# EAGLE schematic v1.0 (EAGLE 8.2.1)

## Sheet 1 of 8: Digital
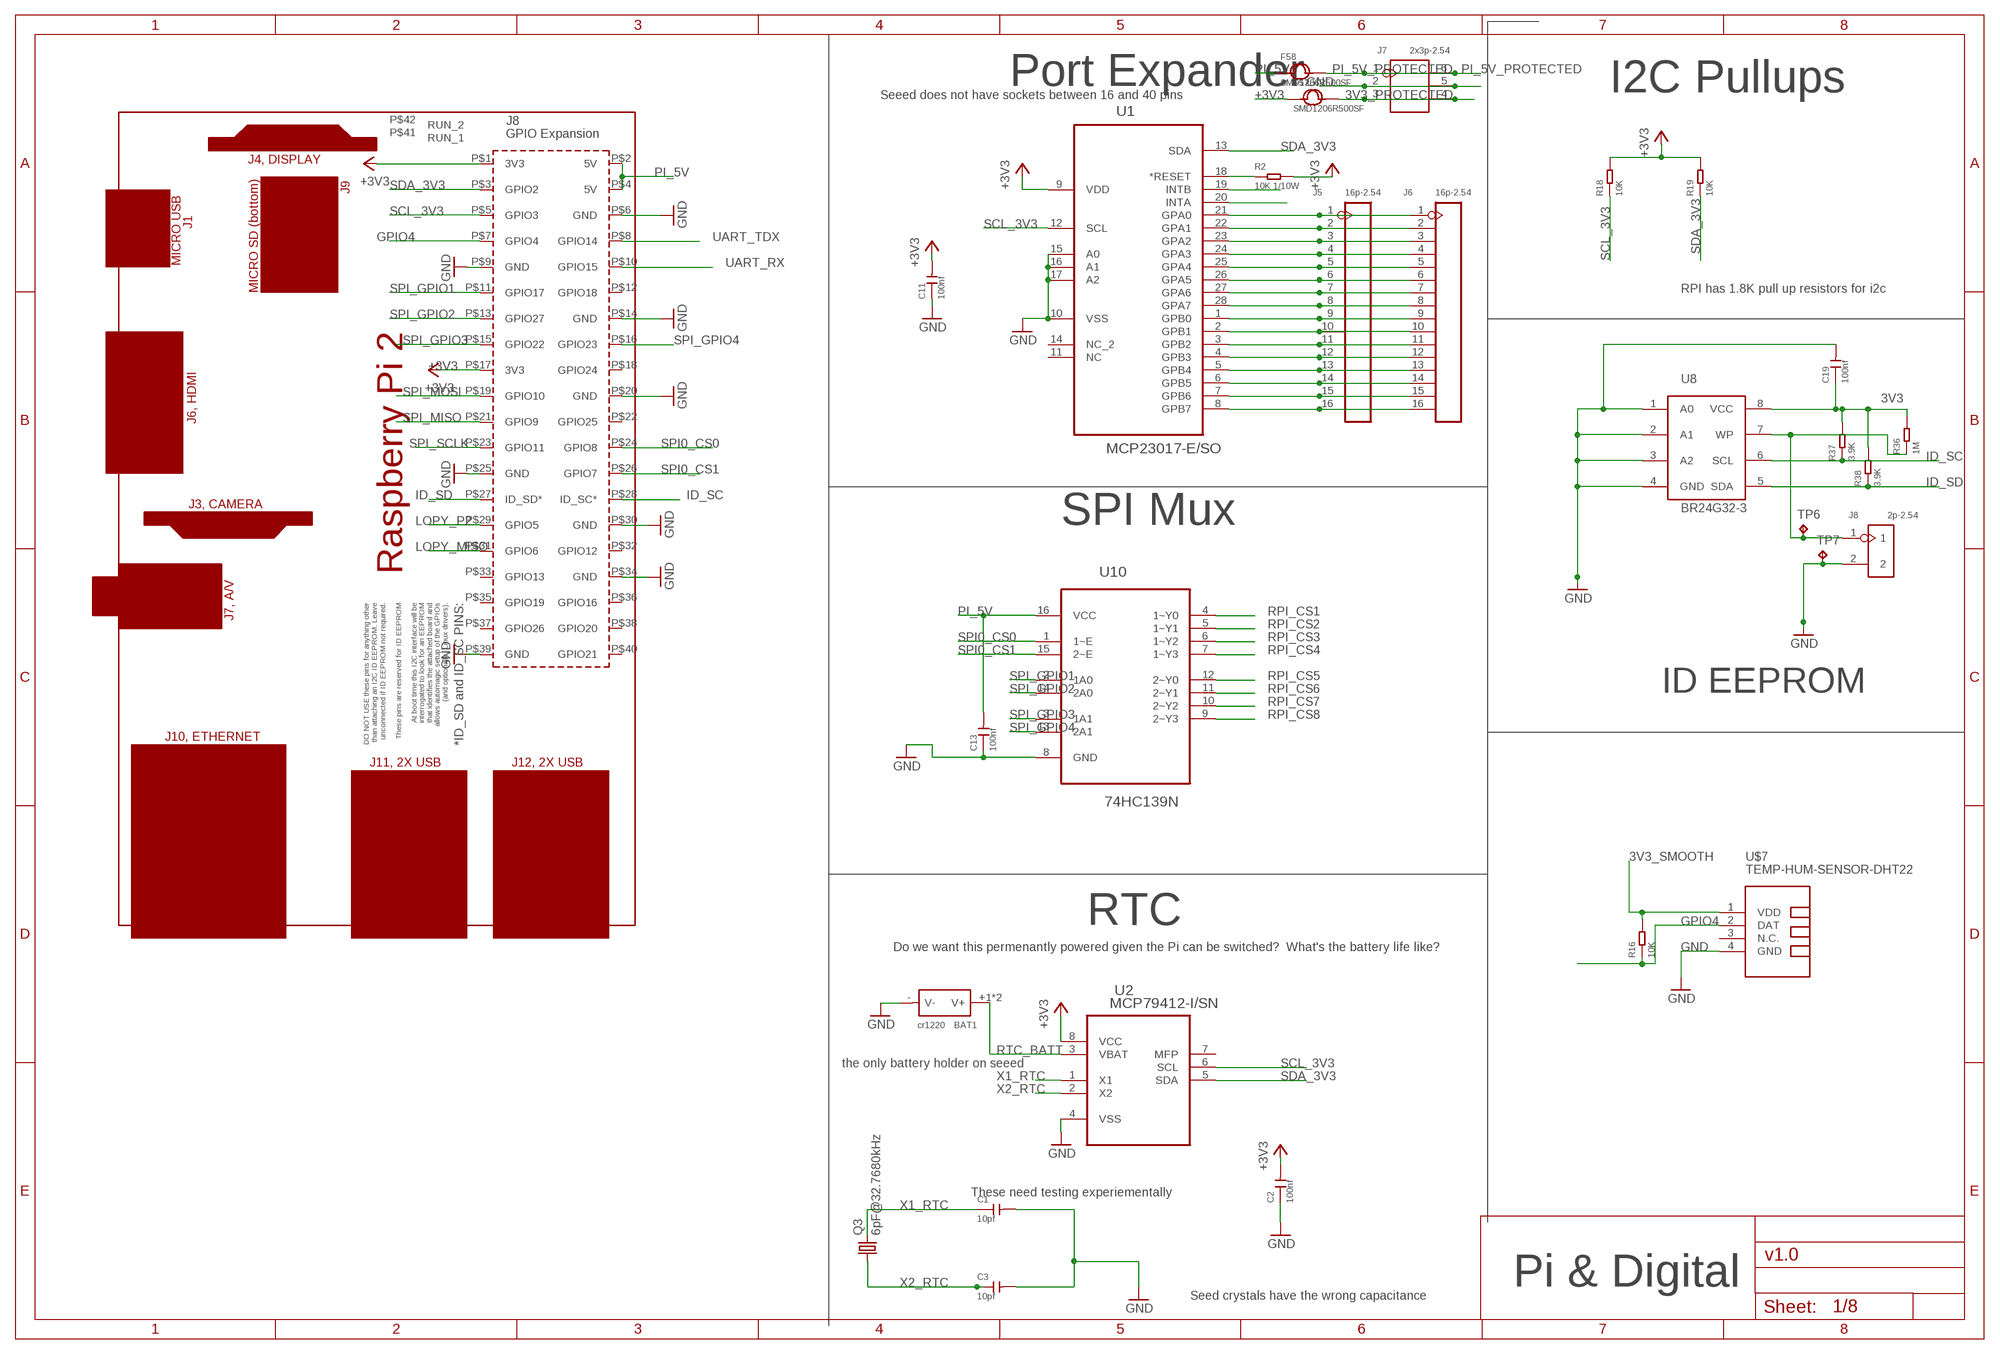
[diagram p0: schematic, sheet 1]

### Parts
BAT1  cr1220  DIP-BATTERY-CELL-HOLDER(1220)  [BAT2P-13.5-CR1220]
C1  10pf  CERAMIC-10PF-50V-5%-NPO(0603)  [C0603]
C2  100nf  CERAMIC-100NF-50V-10%-X7R(0603)  [C0603]
C3  10pf  CERAMIC-10PF-50V-5%-NPO(0603)  [C0603]
C11  100nf  CERAMIC-100NF-50V-10%-X7R(0603)  [C0603]
C13  100nf  CERAMIC-100NF-50V-10%-X7R(0603)  [C0603]
C19  100nf  CERAMIC-100NF-50V-10%-X7R(0603)  [C0603]
F57  SMD1206R500SF  SMD-PPTC-500MA(1206)  [F1206]
F58  SMD1206R500SF  SMD-PPTC-500MA(1206)  [F1206]
J5  16p-2.54  DIP-BLACK-MALE-HEADER-VERT(16P-2.54)  [H16-2.54]
J6  16p-2.54  DIP-BLACK-MALE-HEADER-VERT(16P-2.54)  [H16-2.54]
J7  2x3p-2.54  DIP-BLACK-MALE-HEADER(2X3P-2.54）-2.54  [H2X3-2.54]
J8  2p-2.54  DIP-BLACK-ROUND-FEMALE-HEADER-VERT(2P-2.54)  [H2-2.54]
PCB1  RPI2  [RPI2]
Q3  6pF@32.7680kHz  CRYTAL68SMX  [86SMX]
R2  10K 1/10W  SMD-RES-10K-5%-1/10W(0603)  [R0603]
R16  10K  SMD-RES-10K-1%-1/10W(0603)  [R0603]
R18  10K  SMD-RES-10K-1%-1/10W(0603)  [R0603]
R19  10K  SMD-RES-10K-1%-1/10W(0603)  [R0603]
R36  1M  SMD-RES-1M-1%-1/10W(0603)  [R0603]
R37  3.9K  SMD-RES-3.9K-5%-1/10W(0603)  [R0603]
R38  3.9K  SMD-RES-3.9K-5%-1/10W(0603)  [R0603]
TP6  TPB2,54  [B2,54]
TP7  TPB2,54  [B2,54]
U1  MCP23017-E/SO  [SOIC127P1032X265-28N]
U2  MCP79412-I/SN  [SOIC127P600X175-8N]
U8  BR24G32-3  [SOP8]
U10  74HC139N  [DIP254P762X420-16]
U$7  TEMP-HUM-SENSOR-DHT22  [TEMP-HUM-SENSOR-DHT22]

### Nets
3V3: C19.1 R36.2 R37.2 R38.2 U8.8(VCC)
3V3_PROTECTED: F57.2 J7.3 J7.4
3V3_SMOOTH: R16.2 U$7.1(VDD) ; also sheet 3,5,6
+3V3: C2.2 C11.2 F57.1 PCB1.P$1(3V3) PCB1.P$17(3V3) R2.2 R18.2 R19.2 U1.9(VDD) U2.8(VCC) ; also sheet 3,5
GND: BAT1.-(V-) C1.2 C2.1 C3.2 C11.1 C13.1 C19.2 J7.2 J7.5 J8.2 PCB1.P$6(GND) PCB1.P$9(GND) PCB1.P$14(GND) PCB1.P$20(GND) PCB1.P$25(GND) PCB1.P$30(GND) PCB1.P$34(GND) PCB1.P$39(GND) TP7.TP U1.10(VSS) U1.15(A0) U1.16(A1) U1.17(A2) U2.4(VSS) U8.1(A0) U8.2(A1) U8.3(A2) U8.4(GND) U10.8(GND) U$7.4(GND) ; also sheet 2,3,5,6,7,8
GPIO4: PCB1.P$7(GPIO4) R16.1 U$7.2(DAT)
ID_SC: PCB1.P$28(ID_SC*) R37.1 U8.6(SCL)
ID_SD: PCB1.P$27(ID_SD*) R38.1 U8.5(SDA)
LOPY_MISO: PCB1.P$31(GPIO6) ; also sheet 2
LOPY_P2: PCB1.P$29(GPIO5) ; also sheet 2
N$1: R2.1 U1.18(*RESET)
N$2: U1.19(INTB)
N$3: U1.20(INTA)
N$8: J5.1 J6.1 U1.21(GPA0)
N$12: J5.2 J6.2 U1.22(GPA1)
N$13: J5.3 J6.3 U1.23(GPA2)
N$14: J5.4 J6.4 U1.24(GPA3)
N$15: J5.5 J6.5 U1.25(GPA4)
N$16: J5.6 J6.6 U1.26(GPA5)
N$19: J5.7 J6.7 U1.27(GPA6)
N$22: J5.8 J6.8 U1.28(GPA7)
N$24: J5.9 J6.9 U1.1(GPB0)
N$26: J5.10 J6.10 U1.2(GPB1)
N$27: J5.11 J6.11 U1.3(GPB2)
N$35: J5.12 J6.12 U1.4(GPB3)
N$36: J5.13 J6.13 U1.5(GPB4)
N$37: J5.14 J6.14 U1.6(GPB5)
N$39: J5.15 J6.15 U1.7(GPB6)
N$40: J5.16 J6.16 U1.8(GPB7)
N$97: J8.1 R36.1 TP6.TP U8.7(WP)
PI_5V: C13.2 F58.1 PCB1.P$2(5V) PCB1.P$4(5V) U10.16(VCC) ; also sheet 3,5,6,7,8
PI_5V_PROTECTED: F58.2 J7.1 J7.6
RPI_CS1: U10.4(1~Y0) ; also sheet 6
RPI_CS2: U10.5(1~Y1) ; also sheet 6
RPI_CS3: U10.6(1~Y2) ; also sheet 6
RPI_CS4: U10.7(1~Y3) ; also sheet 6
RPI_CS5: U10.12(2~Y0) ; also sheet 6
RPI_CS6: U10.11(2~Y1) ; also sheet 6
RPI_CS7: U10.10(2~Y2) ; also sheet 6
RPI_CS8: U10.9(2~Y3) ; also sheet 6
RTC_BATT: BAT1.+1(V+) BAT1.+2(V+) U2.3(VBAT)
SCL_3V3: PCB1.P$5(GPIO3) R18.1 U1.12(SCL) U2.6(SCL) ; also sheet 4,6
SDA_3V3: PCB1.P$3(GPIO2) R19.1 U1.13(SDA) U2.5(SDA) ; also sheet 4,6
SPI0_CS0: PCB1.P$24(GPIO8) U10.1(1~E)
SPI0_CS1: PCB1.P$26(GPIO7) U10.15(2~E)
SPI_GPIO1: PCB1.P$11(GPIO17) U10.2(1A0)
SPI_GPIO2: PCB1.P$13(GPIO27) U10.14(2A0)
SPI_GPIO3: PCB1.P$15(GPIO22) U10.3(1A1)
SPI_GPIO4: PCB1.P$16(GPIO23) U10.13(2A1)
SPI_MISO: PCB1.P$21(GPIO9) ; also sheet 6
SPI_MOSI: PCB1.P$19(GPIO10) ; also sheet 6
SPI_SCLK: PCB1.P$23(GPIO11) ; also sheet 6
UART_RX: PCB1.P$10(GPIO15) ; also sheet 6
UART_TDX: PCB1.P$8(GPIO14) ; also sheet 6
X1_RTC: C1.1 Q3.4 U2.1(X1)
X2_RTC: C3.1 Q3.1 U2.2(X2)
Unconnected: PCB1.P$12(GPIO18) PCB1.P$18(GPIO24) PCB1.P$22(GPIO25) PCB1.P$32(GPIO12) PCB1.P$33(GPIO13) PCB1.P$35(GPIO19) PCB1.P$36(GPIO16) PCB1.P$37(GPIO26) PCB1.P$38(GPIO20) PCB1.P$40(GPIO21) PCB1.P$41(RUN_1) PCB1.P$42(RUN_2) U1.11(NC) U1.14(NC_2) U2.7(MFP) U$7.3(N.C.)

### Notes on the sheet
- Port Expander | I2C Pullups
- Seeed does not have sockets between 16 and 40 pins
- RPI has 1.8K pull up resistors for i2c
- SPI Mux
- ID EEPROM
- RTC
- Do we want this permenantly powered given the Pi can be switched?  What's the battery life like?
- the only battery holder on seeed
- These need testing experiementally
- Pi & Digital
- Seed crystals have the wrong capacitance

## Sheet 2 of 8: PyCom
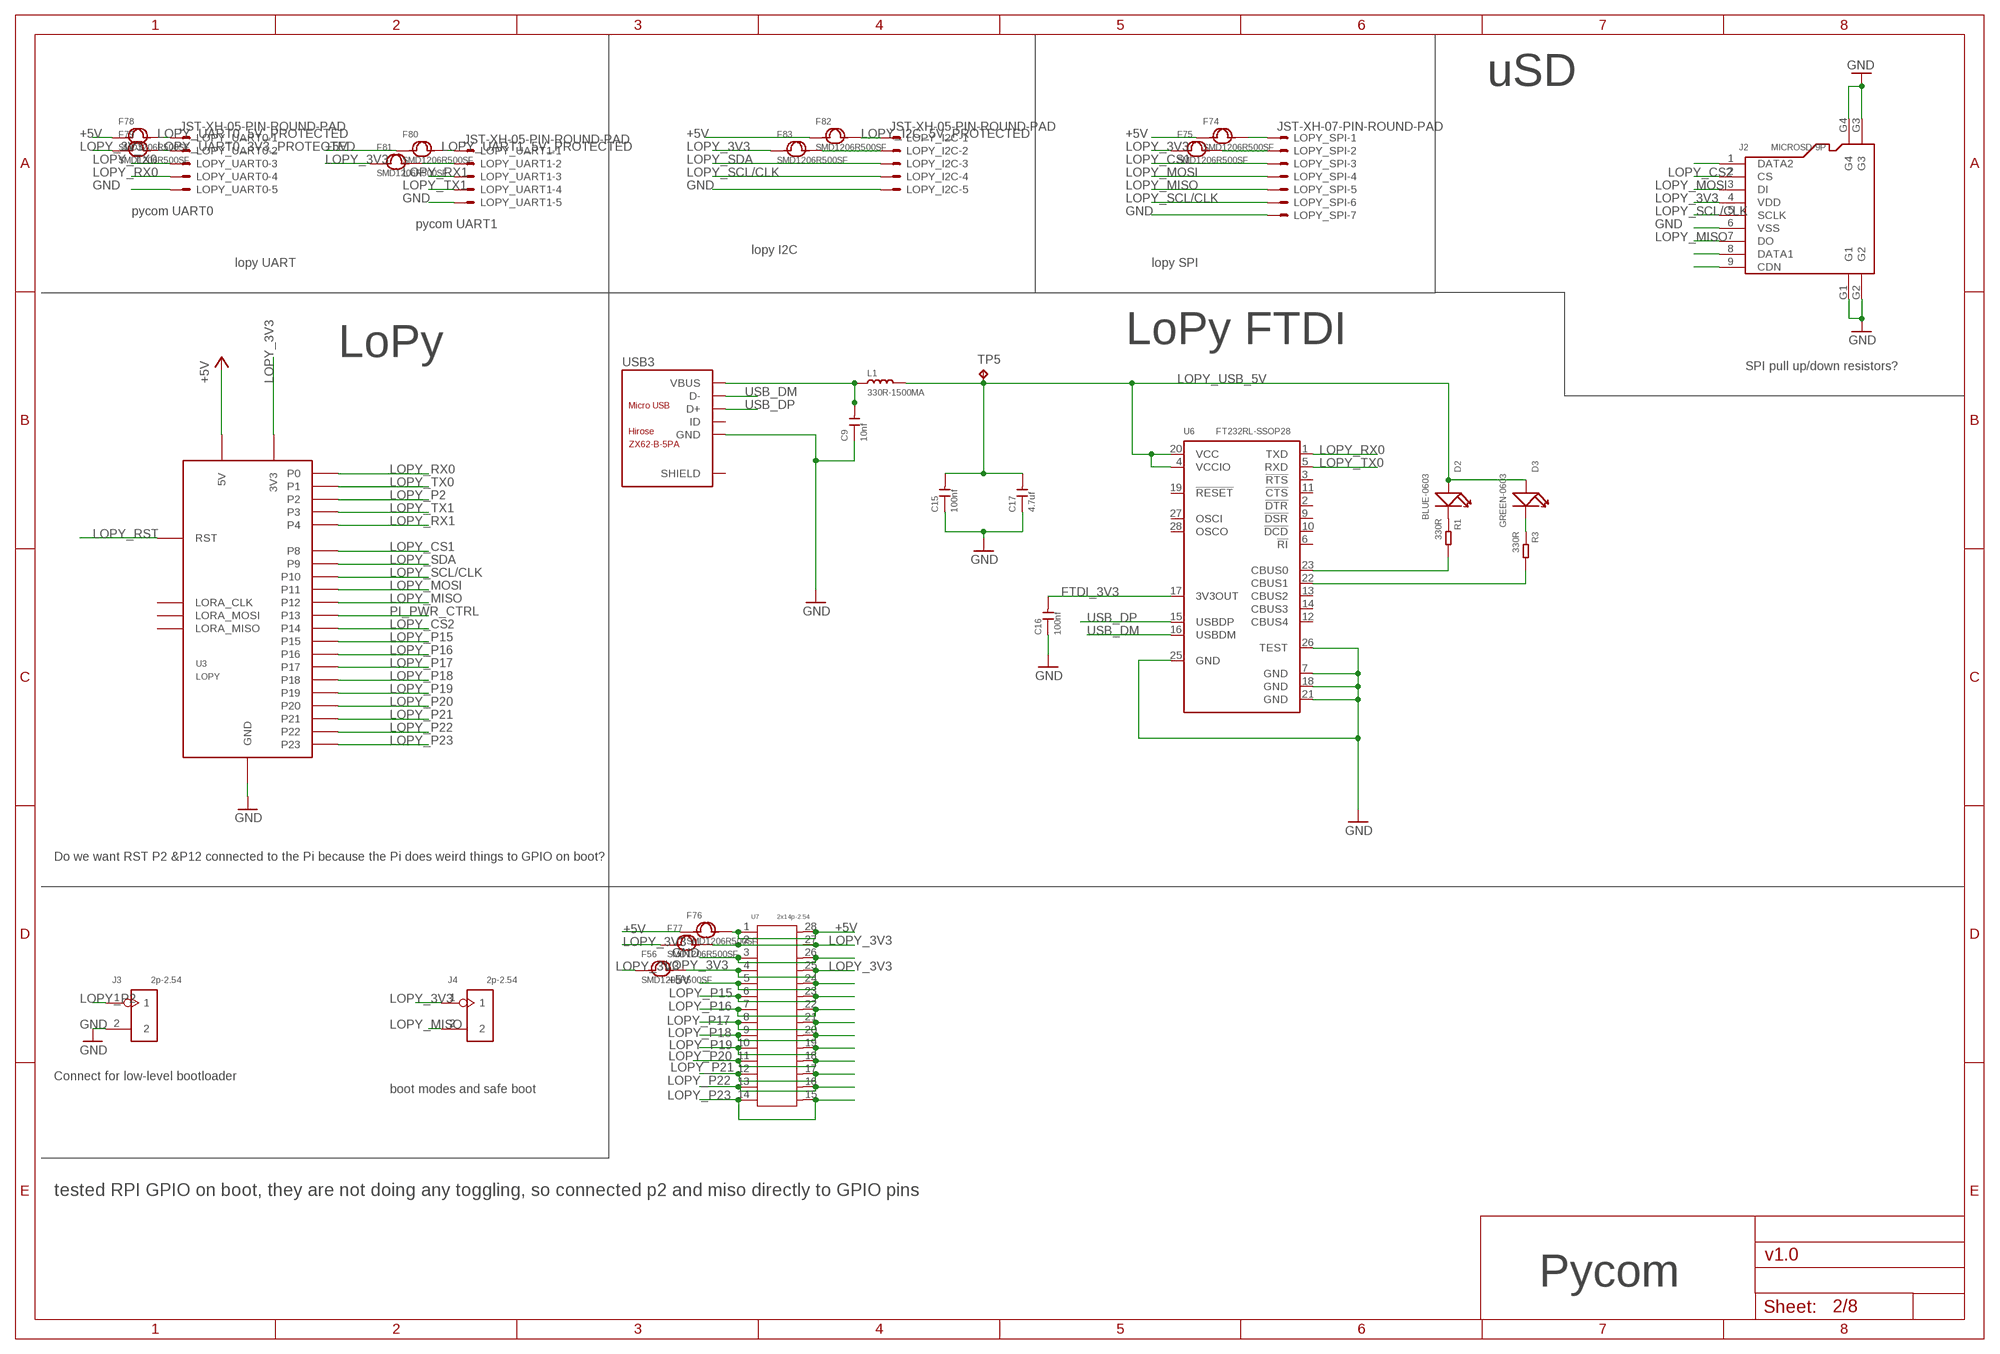
[diagram p1: schematic, sheet 2]

### Parts
C9  10nf  CERAMIC-10NF-50V-5%-X7R(0805)  [C0805]
C15  100nf  CERAMIC-100NF-50V-10%-X7R(0603)  [C0603]
C16  100nf  CERAMIC-100NF-50V-10%-X7R(0603)  [C0603]
C17  4.7uf  CERAMIC-4.7UF-10V-10%-X5R(0603)  [C0603]
D2  BLUE-0603  SMD-LED-CLEAR-BLUE(0603)  [LED-0603]
D3  GREEN-0603  SMD-LED-CLEAR-GREEN(0603)  [LED-0603]
F56  SMD1206R500SF  SMD-PPTC-500MA(1206)  [F1206]
F74  SMD1206R500SF  SMD-PPTC-500MA(1206)  [F1206]
F75  SMD1206R500SF  SMD-PPTC-500MA(1206)  [F1206]
F76  SMD1206R500SF  SMD-PPTC-500MA(1206)  [F1206]
F77  SMD1206R500SF  SMD-PPTC-500MA(1206)  [F1206]
F78  SMD1206R500SF  SMD-PPTC-500MA(1206)  [F1206]
F79  SMD1206R500SF  SMD-PPTC-500MA(1206)  [F1206]
F80  SMD1206R500SF  SMD-PPTC-500MA(1206)  [F1206]
F81  SMD1206R500SF  SMD-PPTC-500MA(1206)  [F1206]
F82  SMD1206R500SF  SMD-PPTC-500MA(1206)  [F1206]
F83  SMD1206R500SF  SMD-PPTC-500MA(1206)  [F1206]
J2  MICROSD-9P  MICRO-SD-CARD-HOLDER-9P  [MICRO-SD9+4P-SMD-16.1X14.5X1.85MM]
J3  2p-2.54  DIP-BLACK-MALE-HEADER-VERT(2P-2.54)  [H2-2.54]
J4  2p-2.54  DIP-BLACK-MALE-HEADER-VERT(2P-2.54)  [H2-2.54]
L1  330R-1500MA  SMD-FERRITE-BEAD-330R-1500MA(0805)'0805'  [L0805]
LOPY_I2C  JST-XH-05-PIN-ROUND-PAD  [JST-XH-05-PACKAGE-ROUND-PAD]
LOPY_SPI  JST-XH-07-PIN-ROUND-PAD  [JST-XH-07-PACKAGE-ROUND-PAD]
LOPY_UART0  JST-XH-05-PIN-ROUND-PAD  [JST-XH-05-PACKAGE-ROUND-PAD]
LOPY_UART1  JST-XH-05-PIN-ROUND-PAD  [JST-XH-05-PACKAGE-ROUND-PAD]
R1  330R  SMD-RES-330R-1%-1/10W(0603)  [R0603]
R3  330R  SMD-RES-330R-1%-1/10W(0603)  [R0603]
TP5  TPB2,54  [B2,54]
U3  LOPY  [LOPY]
U6  FT232RL-SSOP28  INTERFACE-FT232RL(SSOP28)  [SSOP28-0.65-10.2X5.2MM]
U7  2x14p-2.54  DIP-IC-SOCKET(2X14P-2.54)  [SCK28-2.54-35.6X10MM]
USB3  ZX62-B-5PA  MICRO-USB-SMD(ZX62-B-5PA)  [MICRO-USB5+6P-SMD-0.65-AB]

### Nets
+5V: F74.1 F76.1 F76.2 F78.1 F80.1 F82.1 U3.P$28(5V) U7.1 U7.5 U7.24 U7.28 ; also sheet 3,5
FTDI_3V3: C16.2 U6.17(3V3OUT) ; also sheet 8
GND: C9.1 C15.1 C16.1 C17.1 J2.6(VSS) J2.G1 J2.G2 J2.G3 J2.G4 J3.2 LOPY_I2C.5 LOPY_SPI.7 LOPY_UART0.5 LOPY_UART1.5 U3.P$27(GND) U6.7(GND) U6.18(GND) U6.21(GND) U6.25(GND) U6.26(TEST) U7.3 U7.26 USB3.5(GND) ; also sheet 1,3,5,6,7,8
LOPY_3V3: F56.1 F56.2 F75.1 F77.1 F77.2 F79.1 F81.1 F83.1 J2.4(VDD) J4.1 U3.P$26(3V3) U7.2 U7.4 U7.25 U7.27 ; also sheet 3,5
LOPY_CS1: LOPY_SPI.3 U3.P$10(P8)
LOPY_CS2: J2.2(CS) U3.P$16(P14)
LOPY_I2C_3V3_PROTECTED: F83.2 LOPY_I2C.2
LOPY_I2C_5V_PROTECTED: F82.2 LOPY_I2C.1
LOPY_MISO: J2.7(DO) J4.2 LOPY_SPI.5 U3.P$14(P12) ; also sheet 1
LOPY_MOSI: J2.3(DI) LOPY_SPI.4 U3.P$13(P11)
LOPY_P2: J3.1 U3.P$4(P2) ; also sheet 1
LOPY_P15: U3.P$17(P15) U7.6 U7.23
LOPY_P16: U3.P$18(P16) U7.7 U7.22
LOPY_P17: U3.P$19(P17) U7.8 U7.21
LOPY_P18: U3.P$20(P18) U7.9 U7.20
LOPY_P19: U3.P$21(P19) U7.10 U7.19
LOPY_P20: U3.P$22(P20) U7.11 U7.18
LOPY_P21: U3.P$23(P21) U7.12 U7.17
LOPY_P22: U3.P$24(P22) U7.13 U7.16
LOPY_P23: U3.P$25(P23) U7.14 U7.15
LOPY_RST: U3.P$1(RST)
LOPY_RX0: LOPY_UART0.4 U3.P$2(P0) U6.1(TXD)
LOPY_RX1: LOPY_UART1.3 U3.P$6(P4)
LOPY_SCL/CLK: J2.5(SCLK) LOPY_I2C.4 LOPY_SPI.6 U3.P$12(P10)
LOPY_SDA: LOPY_I2C.3 U3.P$11(P9)
LOPY_SPI_3V3_PROTECTED: F75.2 LOPY_SPI.2
LOPY_SPI_5V_PROTECTED: F74.2 LOPY_SPI.1
LOPY_TX0: LOPY_UART0.3 U3.P$3(P1) U6.5(RXD)
LOPY_TX1: LOPY_UART1.4 U3.P$5(P3)
LOPY_UART0_3V3_PROTECTED: F79.2 LOPY_UART0.2
LOPY_UART0_5V_PROTECTED: F78.2 LOPY_UART0.1
LOPY_UART1_3V3_PROTECTED: F81.2 LOPY_UART1.2
LOPY_UART1_5V_PROTECTED: F80.2 LOPY_UART1.1
LOPY_USB_5V: C15.2 C17.2 D2.+ D3.+ L1.2 TP5.TP U6.4(VCCIO) U6.20(VCC) ; also sheet 5
N$6: D2.- R1.1
N$7: D3.- R3.1
N$9: R1.2 U6.23(CBUS0)
N$10: R3.2 U6.22(CBUS1)
N$18: J2.1(DATA2)
N$20: J2.8(DATA1)
N$21: J2.9(CDN)
PI_PWR_CTRL: U3.P$15(P13) ; also sheet 3
USB_DM: U6.16(USBDM) USB3.2(D-)
USB_DP: U6.15(USBDP) USB3.3(D+)
VBUS: C9.2 L1.1 USB3.1(VBUS)
Unconnected: U3.P$7(LORA_CLK) U3.P$8(LORA_MOSI) U3.P$9(LORA_MISO) U6.2(!DTR) U6.3(!RTS) U6.6(!RI) U6.9(!DSR) U6.10(!DCD) U6.11(!CTS) U6.12(CBUS4) U6.13(CBUS2) U6.14(CBUS3) U6.19(!RESET) U6.27(OSCI) U6.28(OSCO) USB3.4(ID) USB3.P1(SHIELD) USB3.P2(SHIELD) USB3.P3(SHIELD) USB3.P4(SHIELD) USB3.P5(SHIELD) USB3.P6(SHIELD)

### Notes on the sheet
- uSD
- pycom UART0
- pycom UART1
- lopy I2C
- lopy UART | lopy SPI
- LoPy | LoPy FTDI
- SPI pull up/down resistors?
- Do we want RST P2 &P12 connected to the Pi because the Pi does weird things to GPIO on boot?
- Connect for low-level bootloader
- boot modes and safe boot
- tested RPI GPIO on boot, they are not doing any toggling, so connected p2 and miso directly to GPIO pins
- Pycom

## Sheet 3 of 8: PSU
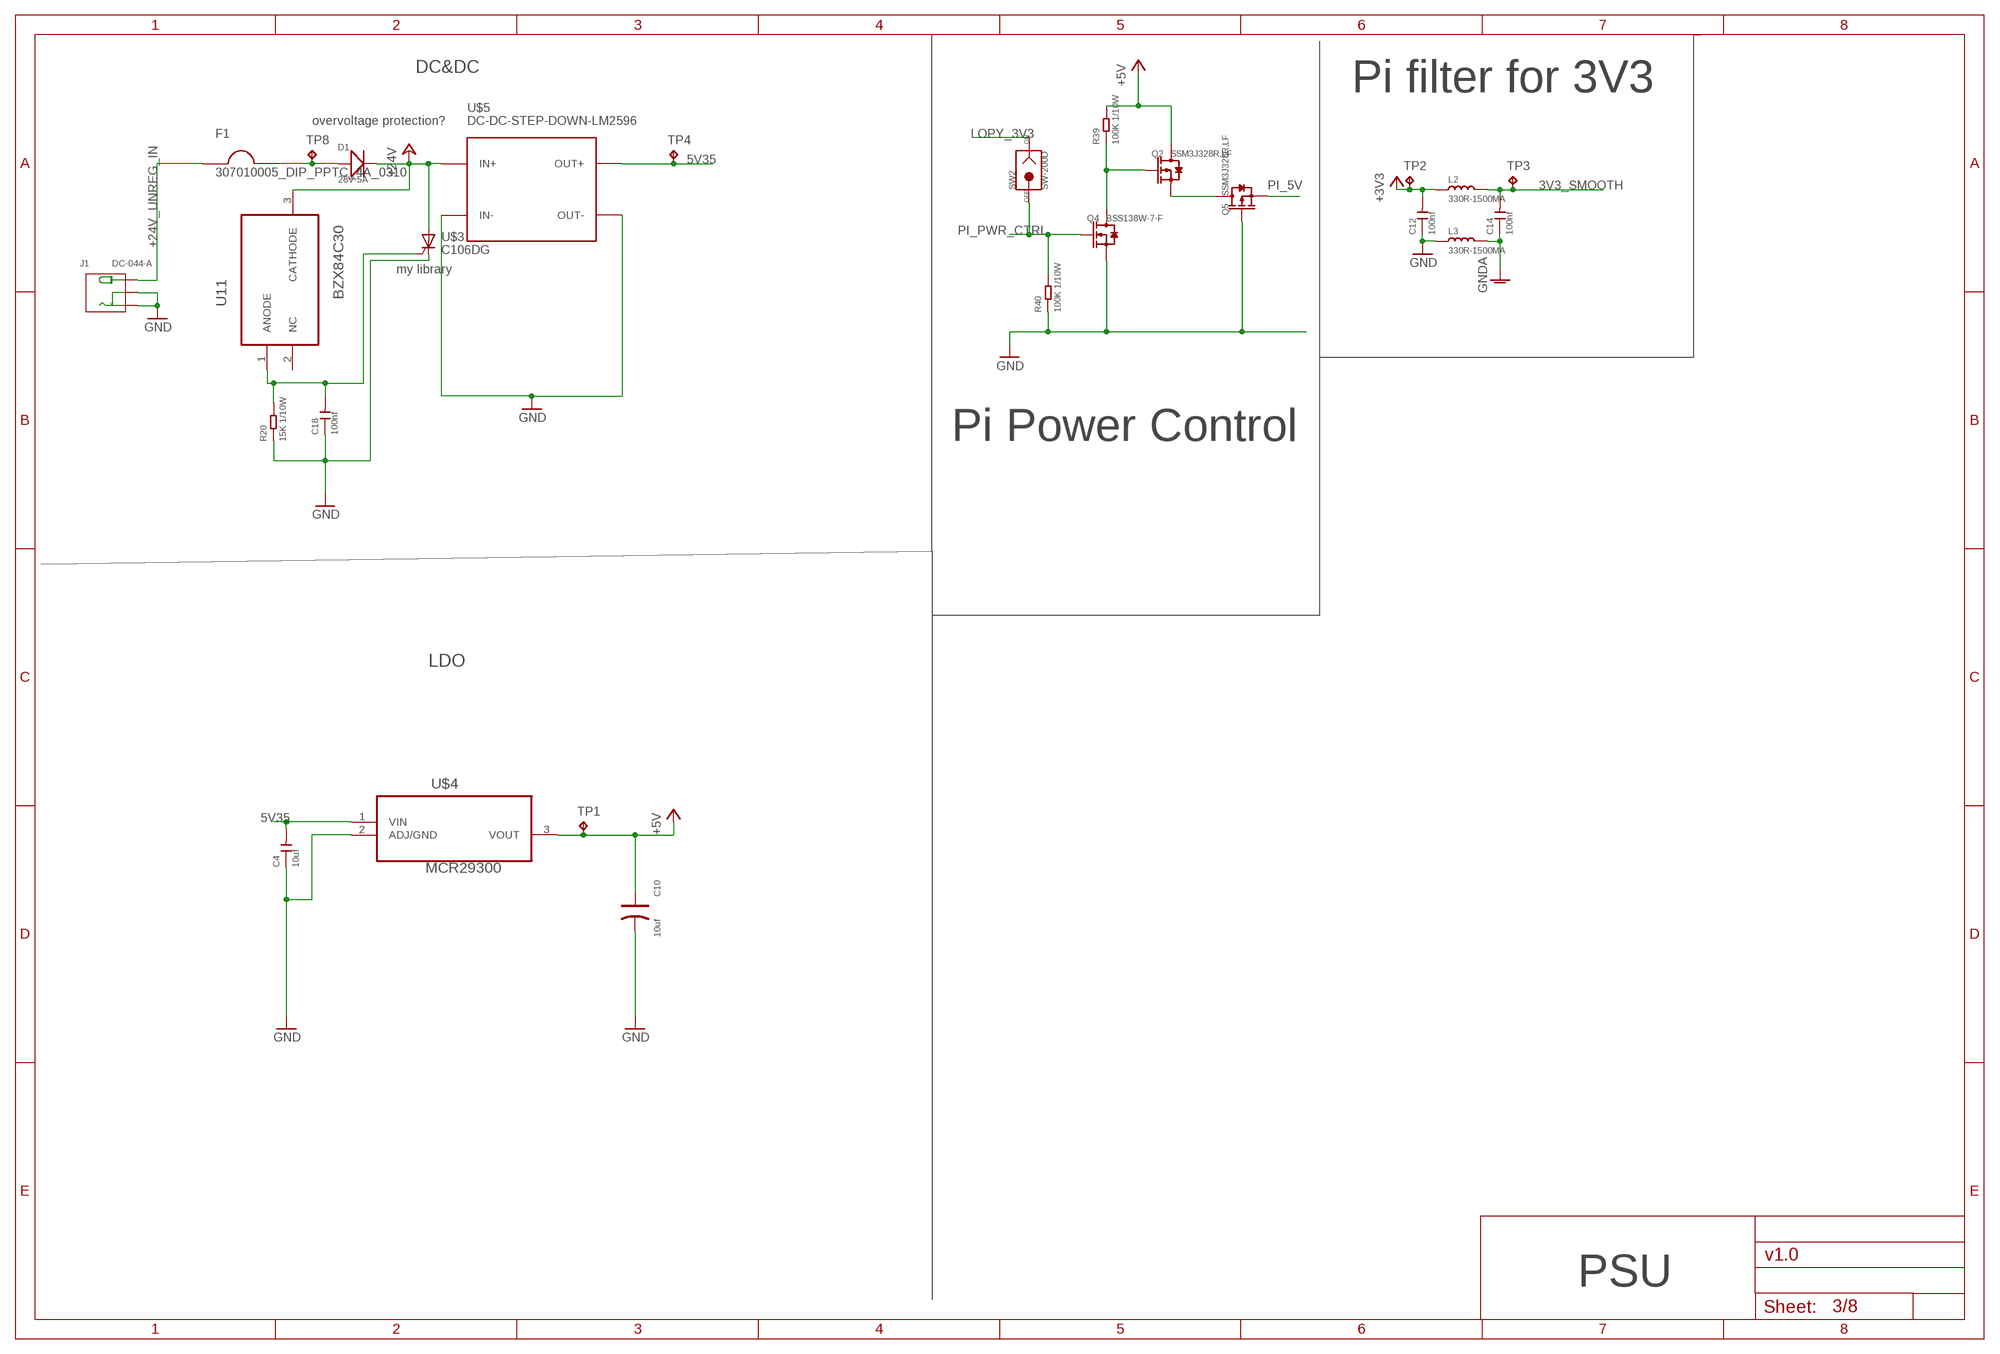
[diagram p2: schematic, sheet 3]

### Parts
C4  10uf  CERAMIC-10UF-10V-10%-X5R(0603)  [C0603]
C10  10uf  TANTALUM-SMD-10UF-10V-10%(AVX-A)  [AVX-A]
C12  100nf  CERAMIC-100NF-50V-10%-X7R(0603)  [C0603]
C14  100nf  CERAMIC-100NF-50V-10%-X7R(0603)  [C0603]
C18  100nf  CERAMIC-100NF-50V-10%-X7R(0603)  [C0603]
D1  28V-5A  SMD-DIODE-SCHOTTKY-28V-5A(DO-214AA)  [DO-214AA]
F1  307010005_DIP_PPTC_4A_0310  [TH_5MM_14MM]
J1  DC-044-A  JACK-DC-044-A  [DCJ3P-11.6X9.6X7.0MM]
L2  330R-1500MA  SMD-FERRITE-BEAD-330R-1500MA(0805)'0805'  [L0805]
L3  330R-1500MA  SMD-FERRITE-BEAD-330R-1500MA(0805)'0805'  [L0805]
Q2  SSM3J328R,LF  SMD-MOSFET-P-CH-20V-6A-SSM3J328R(SOT-23)  [SOT-23]
Q4  BSS138W-7-F  SMD-MOSFET-N-CH-50V-200MA-BSS138W-7-F(SOT-23)  [SOT-23]
Q5  SSM3J328R,LF  SMD-MOSFET-P-CH-20V-6A-SSM3J328R(SOT-23)  [SOT-23]
R20  15K 1/10W  SMD-RES-15K-1%-1/10W(0603)  [R0603]
R39  100K 1/10W  SMD-RES-100K-5%-1/10W(0603)  [R0603]
R40  100K 1/10W  SMD-RES-100K-5%-1/10W(0603)  [R0603]
SW2  SW-200D  DIP-TILT-SWITCH-SW-200D(2P-12X3.6MM)  [SW2-12.7-12.0X3.6X3.6MM]
TP1  TPB2,54  [B2,54]
TP2  TPB2,54  [B2,54]
TP3  TPB2,54  [B2,54]
TP4  TPB2,54  [B2,54]
TP8  TPB2,54  [B2,54]
U11  BZX84C30  [SOT91P240X110-3N]
U$3  C106DG  [TO-225AA]
U$4  MCR29300  [TO-263]
U$5  DC-DC-STEP-DOWN-LM2596  [DC-DC-STEP-DOWN-LM2596]

### Nets
3V3_SMOOTH: C14.2 L2.2 TP3.TP ; also sheet 1,5,6
5V35: C4.2 TP4.TP U$4.1(VIN) U$5.OUT+ ; also sheet 5
+3V3: C12.2 L2.1 TP2.TP ; also sheet 1,5
+5V: C10.+ Q2.3(D) R39.2 TP1.TP U$4.3(VOUT) ; also sheet 2,5
+24V: D1.- U11.3(CATHODE) U$3.1(A) U$5.IN+ ; also sheet 5
+24V_UNREG_IN: F1.P$1 J1.+
GND: C4.1 C10.- C12.1 C18.1 J1.- J1.CDN L3.1 Q4.2(S) Q5.1(G) R20.1 R40.1 U$3.2(C) U$4.2(ADJ/GND) U$5.IN- U$5.OUT- ; also sheet 1,2,5,6,7,8
GNDA: C14.1 L3.2 ; also sheet 4
LOPY_3V3: SW2.1 ; also sheet 2,5
N$68: D1.+ F1.P$2 TP8.TP
N$80: C18.2 R20.2 U11.1(ANODE) U$3.3(G1)
N$122: Q2.2(S) Q5.3(D)
N$123: Q2.1(G) Q4.3(D) R39.1
PI_5V: Q5.2(S) ; also sheet 1,5,6,7,8
PI_PWR_CTRL: Q4.1(G) R40.2 SW2.2 ; also sheet 2
Unconnected: U11.2(NC)

### Notes on the sheet
- DC&DC
- Pi filter for 3V3
- overvoltage protection?
- my library
- Pi Power Control
- LDO
- PSU

## Sheet 4 of 8: ADC
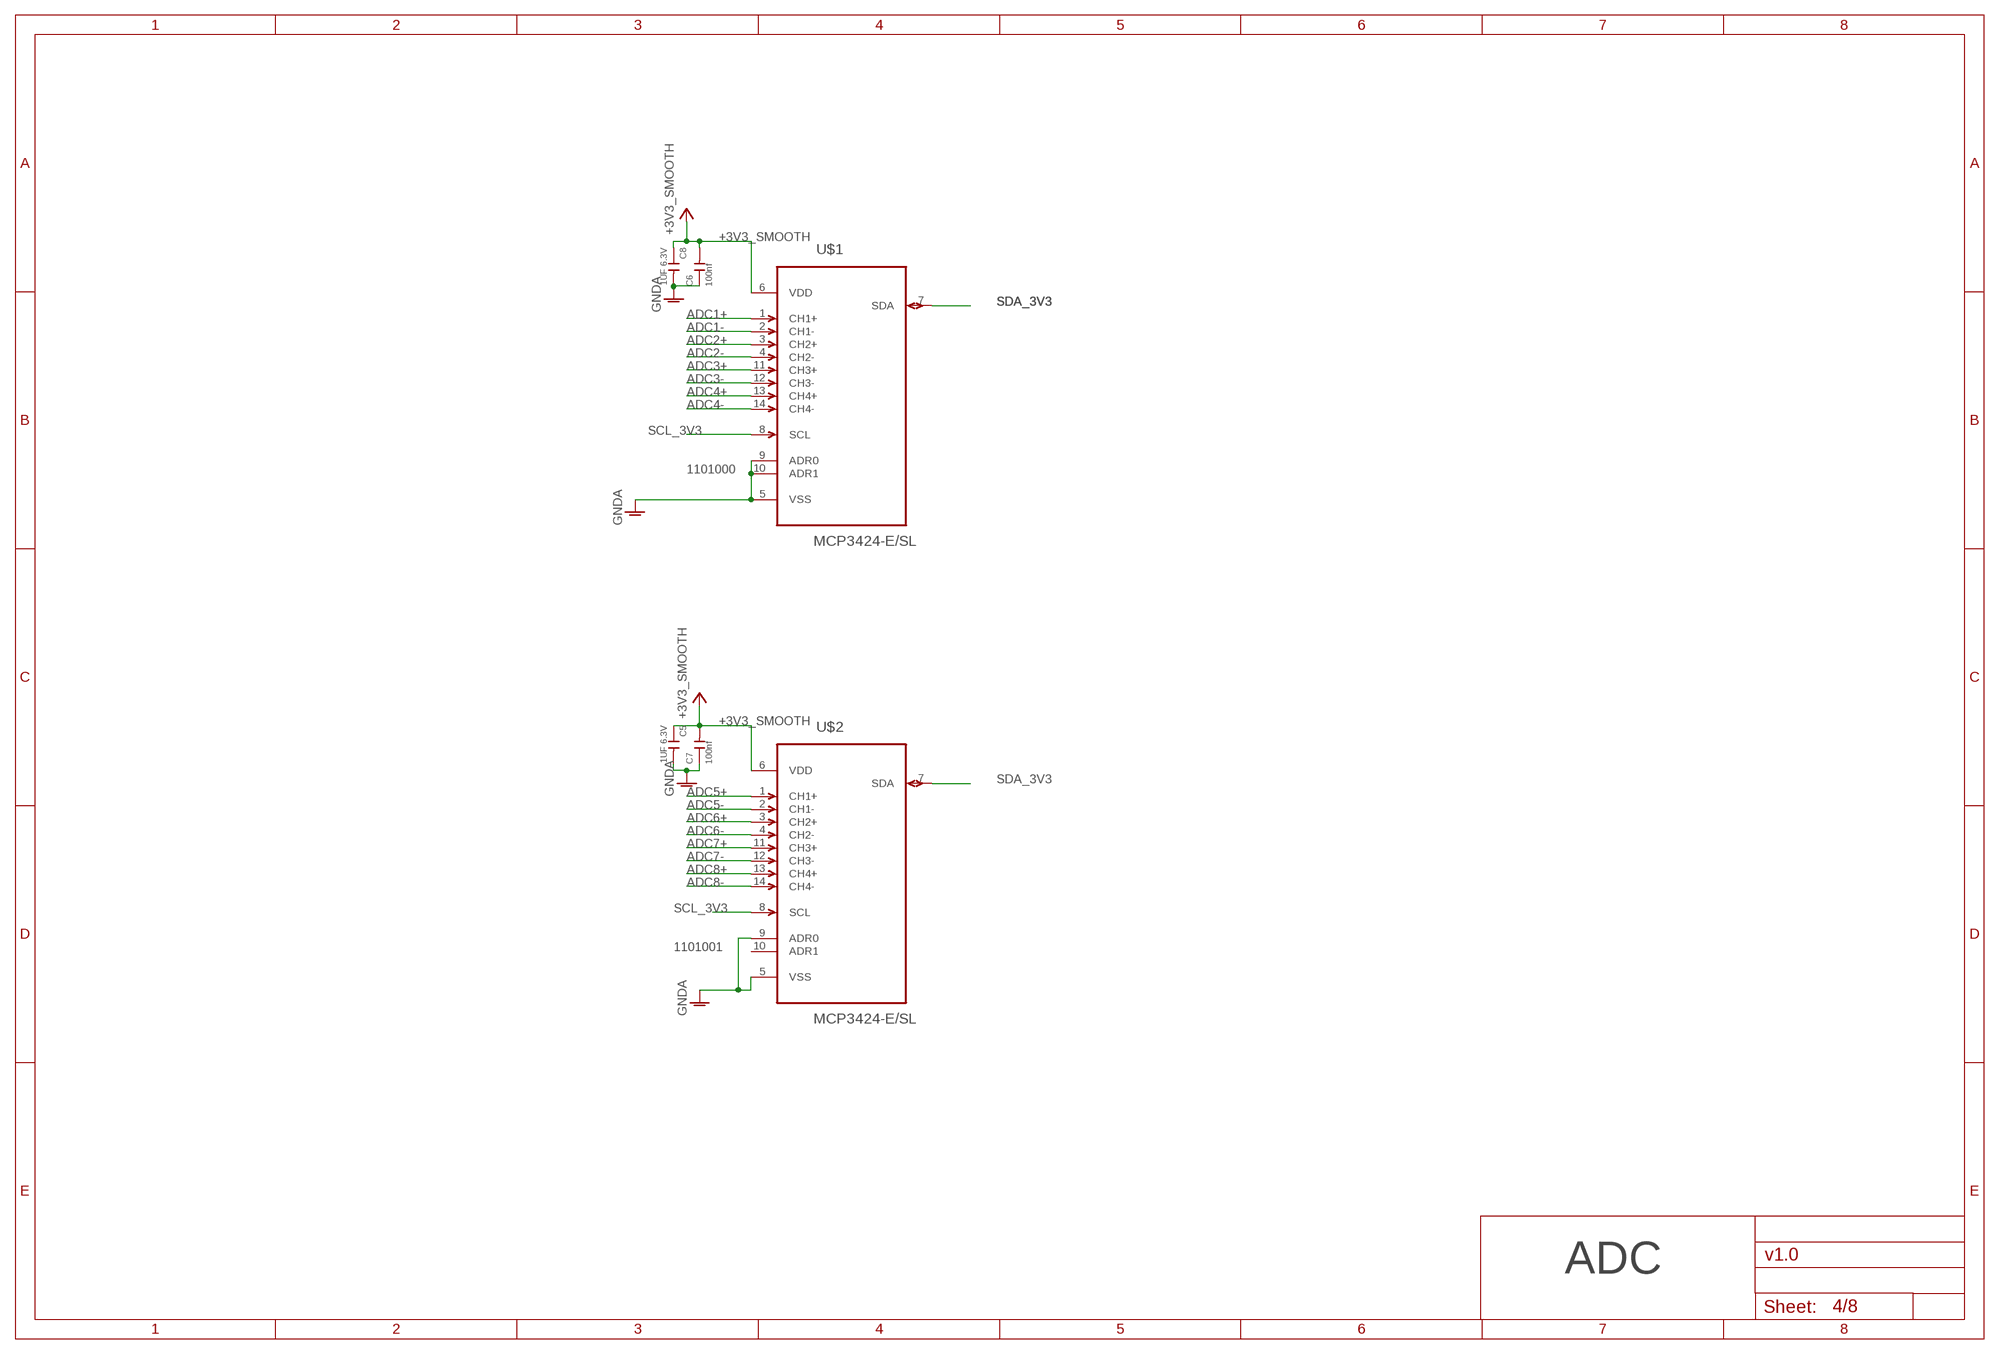
[diagram p3: schematic, sheet 4]

### Parts
C5  1UF 6.3V  CERAMIC-1UF-6.3V-10%-X5R(0402)  [C0402]
C6  100nf  CERAMIC-100NF-50V-10%-X7R(0603)  [C0603]
C7  100nf  CERAMIC-100NF-50V-10%-X7R(0603)  [C0603]
C8  1UF 6.3V  CERAMIC-1UF-6.3V-10%-X5R(0402)  [C0402]
U$1  MCP3424-E/SL  [SOIC127P600X175-14N]
U$2  MCP3424-E/SL  [SOIC127P600X175-14N]

### Nets
+3V3_SMOOTH: C5.1 C6.2 C7.2 C8.1 U$1.6(VDD) U$2.6(VDD)
ADC1+: U$1.1(CH1+) ; also sheet 6
ADC1-: U$1.2(CH1-) ; also sheet 6
ADC2+: U$1.3(CH2+) ; also sheet 6
ADC2-: U$1.4(CH2-) ; also sheet 6
ADC3+: U$1.11(CH3+) ; also sheet 6
ADC3-: U$1.12(CH3-) ; also sheet 6
ADC4+: U$1.13(CH4+) ; also sheet 6
ADC4-: U$1.14(CH4-) ; also sheet 6
ADC5+: U$2.1(CH1+) ; also sheet 6
ADC5-: U$2.2(CH1-) ; also sheet 6
ADC6+: U$2.3(CH2+) ; also sheet 6
ADC6-: U$2.4(CH2-) ; also sheet 6
ADC7+: U$2.11(CH3+) ; also sheet 6
ADC7-: U$2.12(CH3-) ; also sheet 6
ADC8+: U$2.13(CH4+) ; also sheet 6
ADC8-: U$2.14(CH4-) ; also sheet 6
GNDA: C5.2 C6.1 C7.1 C8.2 U$1.5(VSS) U$1.9(ADR0) U$1.10(ADR1) U$2.5(VSS) U$2.9(ADR0) ; also sheet 3
SCL_3V3: U$1.8(SCL) U$2.8(SCL) ; also sheet 1,6
SDA_3V3: U$1.7(SDA) U$2.7(SDA) ; also sheet 1,6
Unconnected: U$2.10(ADR1)

### Notes on the sheet
- 1101000
- 1101001
- ADC

## Sheet 5 of 8: LEDs
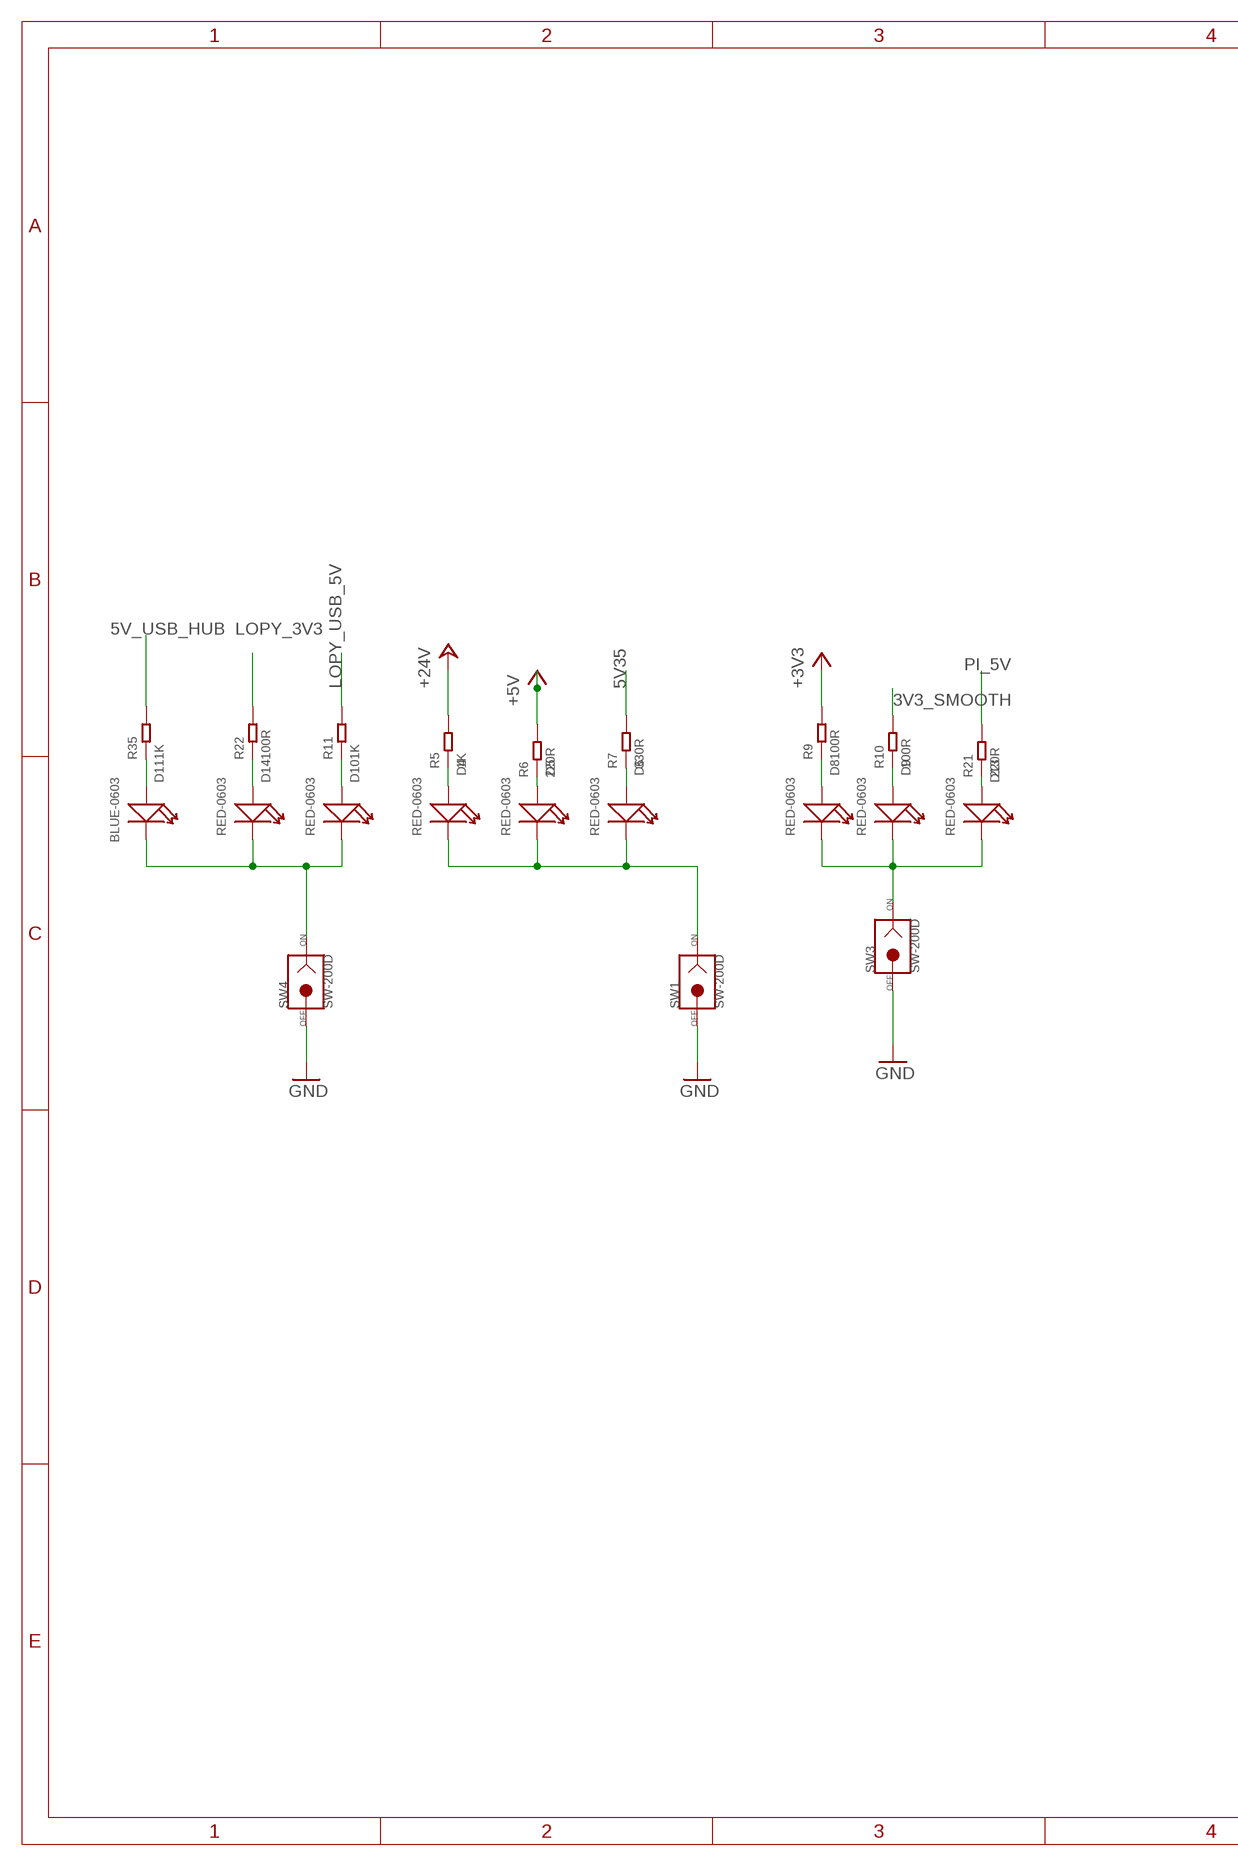
[diagram p4: schematic, sheet 5, part 1 of 2]
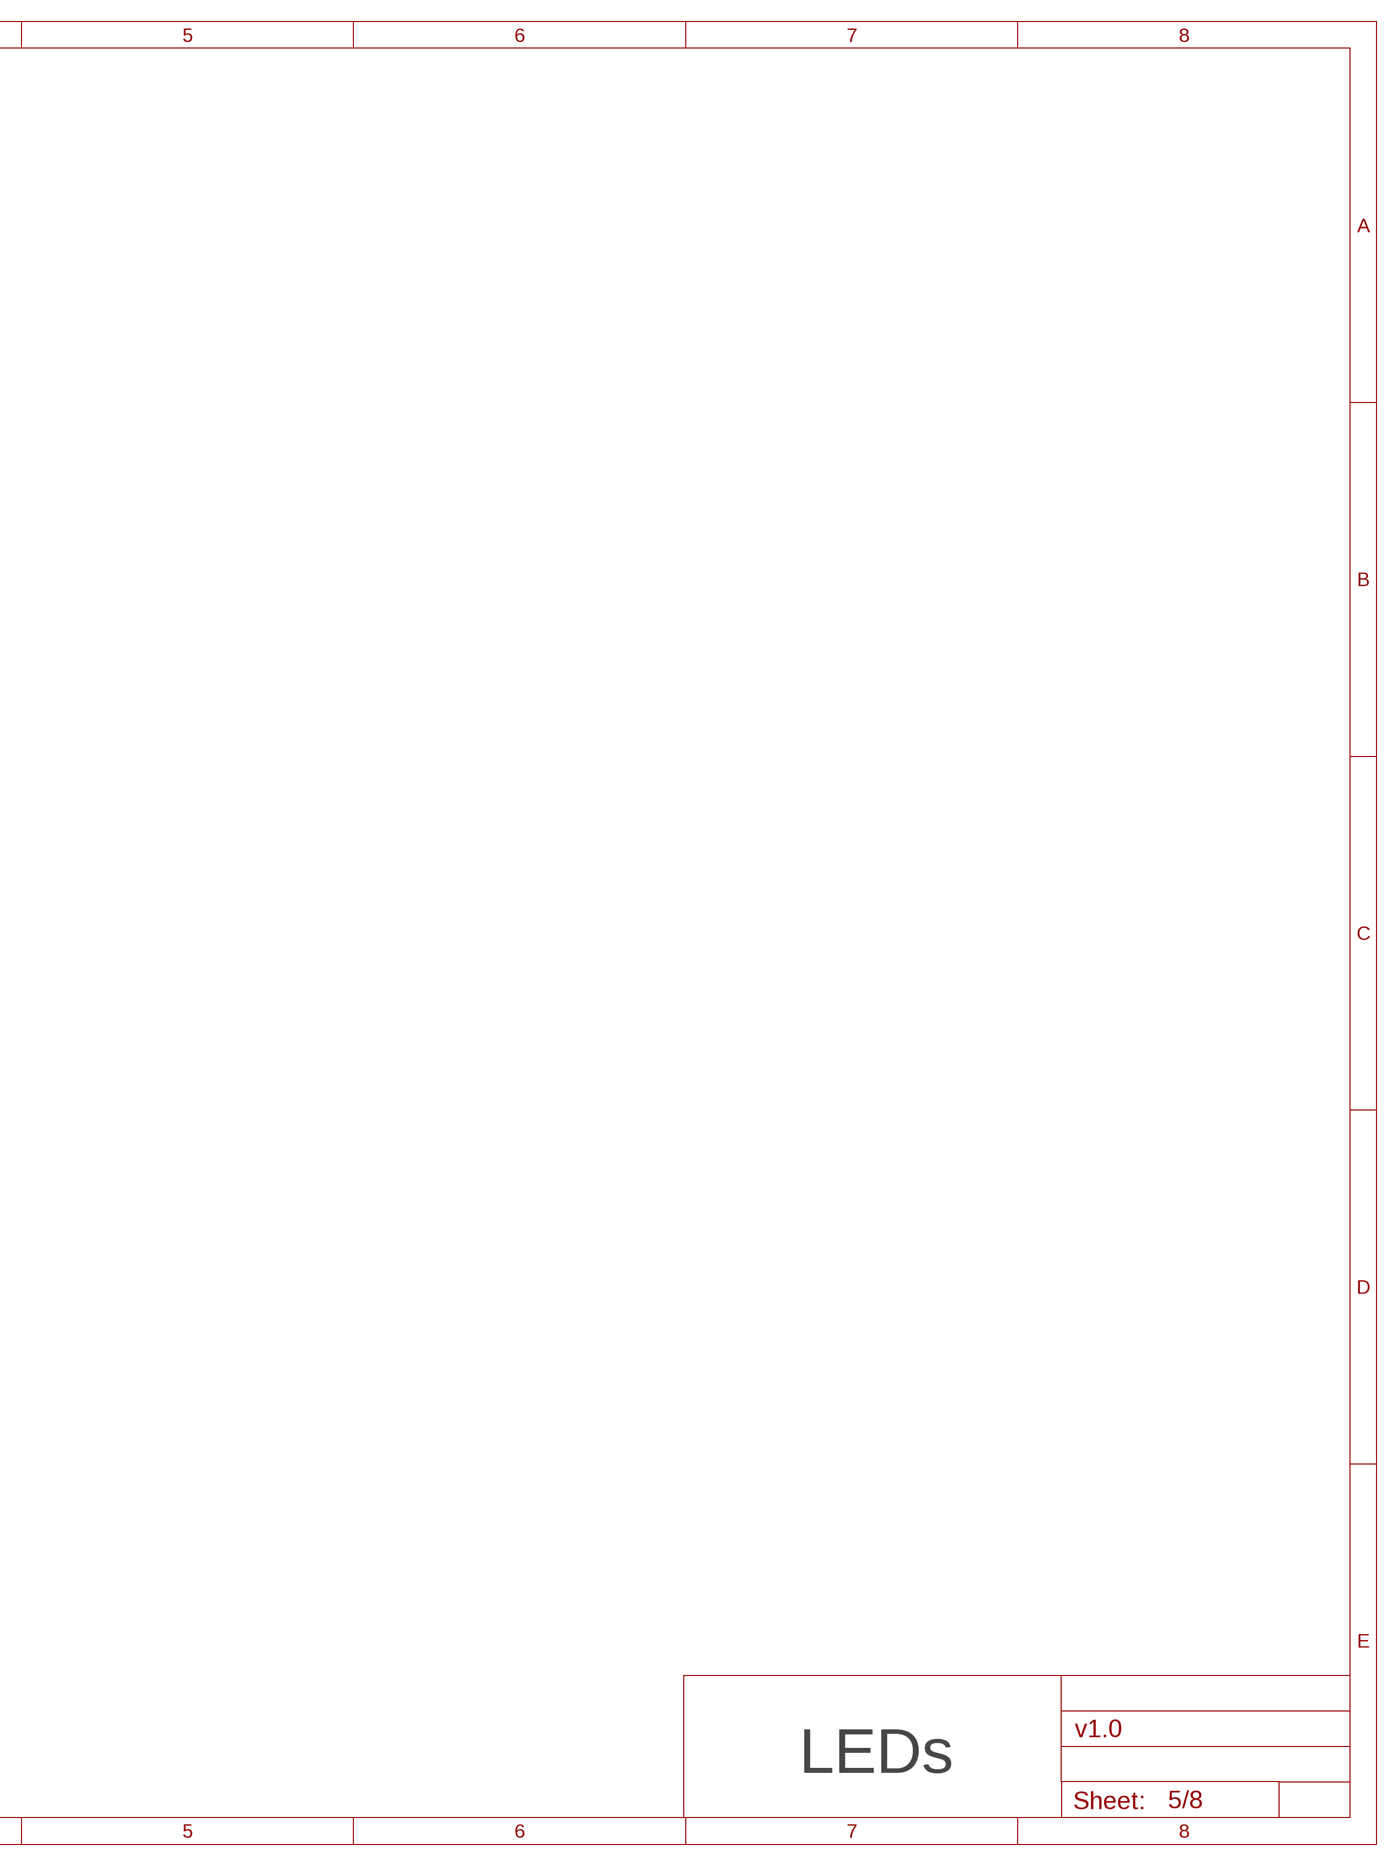
[diagram p5: schematic, sheet 5, part 2 of 2]

### Parts
D4  RED-0603  LED-SMD-RED-DIFFUSED(0603)  [LED-0603]
D5  RED-0603  LED-SMD-RED-DIFFUSED(0603)  [LED-0603]
D6  RED-0603  LED-SMD-RED-DIFFUSED(0603)  [LED-0603]
D8  RED-0603  LED-SMD-RED-DIFFUSED(0603)  [LED-0603]
D9  RED-0603  LED-SMD-RED-DIFFUSED(0603)  [LED-0603]
D10  RED-0603  LED-SMD-RED-DIFFUSED(0603)  [LED-0603]
D11  BLUE-0603  SMD-LED-CLEAR-BLUE(0603)  [LED-0603]
D13  RED-0603  LED-SMD-RED-DIFFUSED(0603)  [LED-0603]
D14  RED-0603  LED-SMD-RED-DIFFUSED(0603)  [LED-0603]
R5  1K  SMD-RES-1K-1%-1/10W(0603)  [R0603]
R6  220R  SMD-RES-220R-5%-1/10W(0603)  [R0603]
R7  330R  SMD-RES-330R-1%-1/10W(0603)  [R0603]
R9  100R  SMD-RES-100R-5%-1/10W(0603)  [R0603]
R10  100R  SMD-RES-100R-5%-1/10W(0603)  [R0603]
R11  1K  SMD-RES-1K-1%-1/10W(0603)  [R0603]
R21  220R  SMD-RES-220R-5%-1/10W(0603)  [R0603]
R22  100R  SMD-RES-100R-5%-1/10W(0603)  [R0603]
R35  1K  SMD-RES-1K-1%-1/10W(0603)  [R0603]
SW1  SW-200D  DIP-TILT-SWITCH-SW-200D(2P-12X3.6MM)  [SW2-12.7-12.0X3.6X3.6MM]
SW3  SW-200D  DIP-TILT-SWITCH-SW-200D(2P-12X3.6MM)  [SW2-12.7-12.0X3.6X3.6MM]
SW4  SW-200D  DIP-TILT-SWITCH-SW-200D(2P-12X3.6MM)  [SW2-12.7-12.0X3.6X3.6MM]

### Nets
3V3_SMOOTH: R10.2 ; also sheet 1,3,6
5V35: R7.2 ; also sheet 3
5V_USB_HUB: R35.2 ; also sheet 7,8
+3V3: R9.2 ; also sheet 1,3
+5V: R6.2 ; also sheet 2,3
+24V: R5.2 ; also sheet 3
GND: SW1.2 SW3.2 SW4.2 ; also sheet 1,2,3,6,7,8
LOPY_3V3: R22.2 ; also sheet 2,3
LOPY_USB_5V: R11.2 ; also sheet 2
N$29: D9.+ R10.1
N$30: D8.+ R9.1
N$32: D6.+ R7.1
N$33: D5.+ R6.1
N$34: D4.+ R5.1
N$61: D11.+ R35.1
N$77: D10.+ R11.1
N$81: D4.- D5.- D6.- SW1.1
N$82: D14.+ R22.1
N$83: D10.- D11.- D14.- SW4.1
N$86: D8.- D9.- D13.- SW3.1
N$87: D13.+ R21.1
PI_5V: R21.2 ; also sheet 1,3,6,7,8

### Notes on the sheet
- LEDs

## Sheet 6 of 8
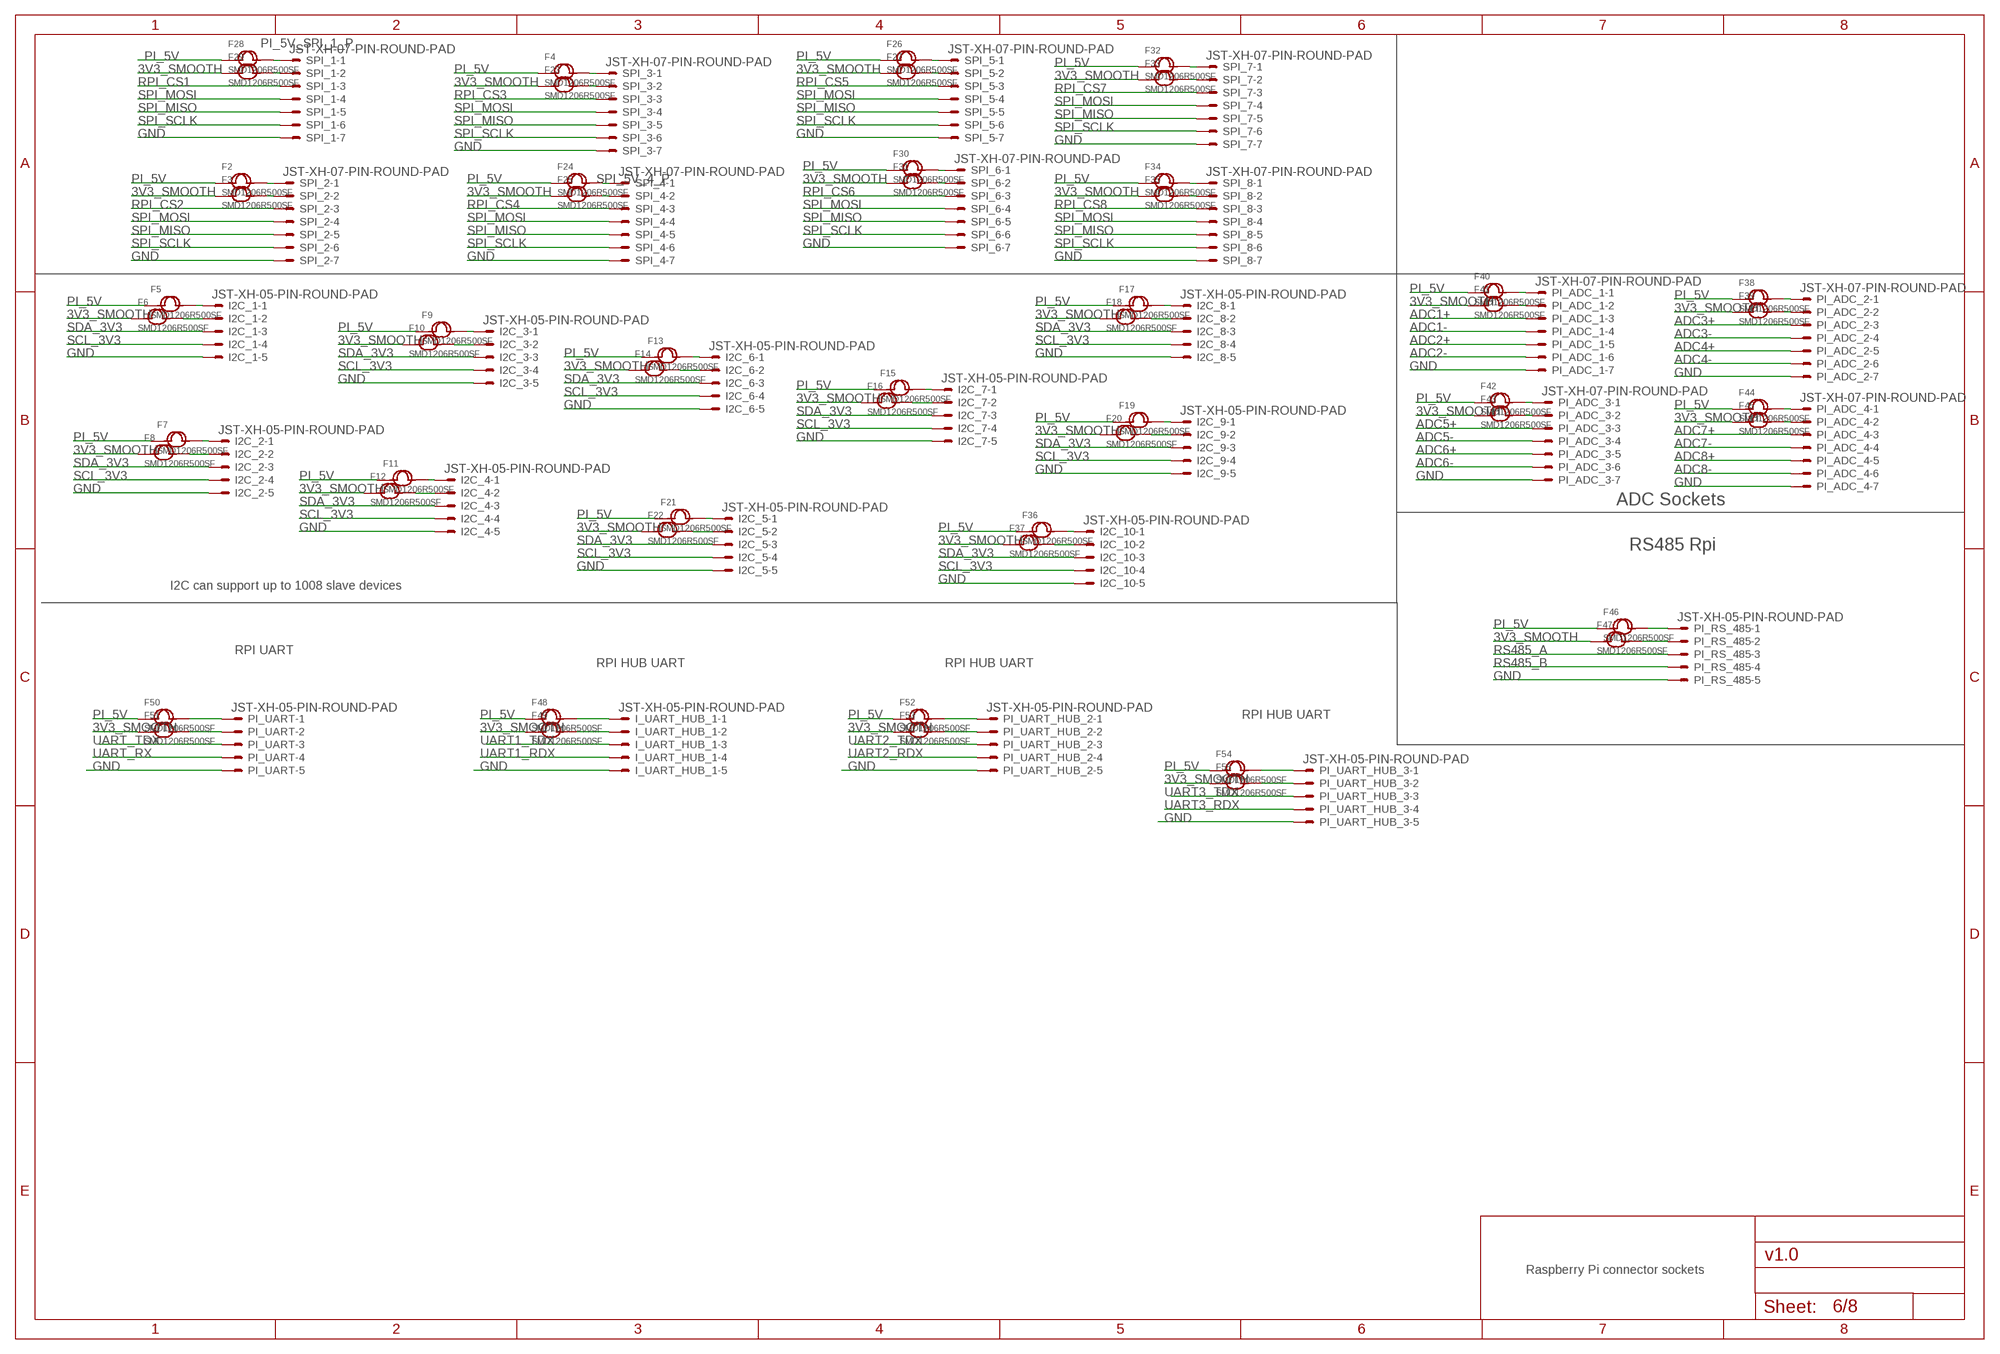
[diagram p6: schematic, sheet 6]

### Parts
F2  SMD1206R500SF  SMD-PPTC-500MA(1206)  [F1206]
F3  SMD1206R500SF  SMD-PPTC-500MA(1206)  [F1206]
F4  SMD1206R500SF  SMD-PPTC-500MA(1206)  [F1206]
F5  SMD1206R500SF  SMD-PPTC-500MA(1206)  [F1206]
F6  SMD1206R500SF  SMD-PPTC-500MA(1206)  [F1206]
F7  SMD1206R500SF  SMD-PPTC-500MA(1206)  [F1206]
F8  SMD1206R500SF  SMD-PPTC-500MA(1206)  [F1206]
F9  SMD1206R500SF  SMD-PPTC-500MA(1206)  [F1206]
F10  SMD1206R500SF  SMD-PPTC-500MA(1206)  [F1206]
F11  SMD1206R500SF  SMD-PPTC-500MA(1206)  [F1206]
F12  SMD1206R500SF  SMD-PPTC-500MA(1206)  [F1206]
F13  SMD1206R500SF  SMD-PPTC-500MA(1206)  [F1206]
F14  SMD1206R500SF  SMD-PPTC-500MA(1206)  [F1206]
F15  SMD1206R500SF  SMD-PPTC-500MA(1206)  [F1206]
F16  SMD1206R500SF  SMD-PPTC-500MA(1206)  [F1206]
F17  SMD1206R500SF  SMD-PPTC-500MA(1206)  [F1206]
F18  SMD1206R500SF  SMD-PPTC-500MA(1206)  [F1206]
F19  SMD1206R500SF  SMD-PPTC-500MA(1206)  [F1206]
F20  SMD1206R500SF  SMD-PPTC-500MA(1206)  [F1206]
F21  SMD1206R500SF  SMD-PPTC-500MA(1206)  [F1206]
F22  SMD1206R500SF  SMD-PPTC-500MA(1206)  [F1206]
F23  SMD1206R500SF  SMD-PPTC-500MA(1206)  [F1206]
F24  SMD1206R500SF  SMD-PPTC-500MA(1206)  [F1206]
F25  SMD1206R500SF  SMD-PPTC-500MA(1206)  [F1206]
F26  SMD1206R500SF  SMD-PPTC-500MA(1206)  [F1206]
F27  SMD1206R500SF  SMD-PPTC-500MA(1206)  [F1206]
F28  SMD1206R500SF  SMD-PPTC-500MA(1206)  [F1206]
F29  SMD1206R500SF  SMD-PPTC-500MA(1206)  [F1206]
F30  SMD1206R500SF  SMD-PPTC-500MA(1206)  [F1206]
F31  SMD1206R500SF  SMD-PPTC-500MA(1206)  [F1206]
F32  SMD1206R500SF  SMD-PPTC-500MA(1206)  [F1206]
F33  SMD1206R500SF  SMD-PPTC-500MA(1206)  [F1206]
F34  SMD1206R500SF  SMD-PPTC-500MA(1206)  [F1206]
F35  SMD1206R500SF  SMD-PPTC-500MA(1206)  [F1206]
F36  SMD1206R500SF  SMD-PPTC-500MA(1206)  [F1206]
F37  SMD1206R500SF  SMD-PPTC-500MA(1206)  [F1206]
F38  SMD1206R500SF  SMD-PPTC-500MA(1206)  [F1206]
F39  SMD1206R500SF  SMD-PPTC-500MA(1206)  [F1206]
F40  SMD1206R500SF  SMD-PPTC-500MA(1206)  [F1206]
F41  SMD1206R500SF  SMD-PPTC-500MA(1206)  [F1206]
F42  SMD1206R500SF  SMD-PPTC-500MA(1206)  [F1206]
F43  SMD1206R500SF  SMD-PPTC-500MA(1206)  [F1206]
F44  SMD1206R500SF  SMD-PPTC-500MA(1206)  [F1206]
F45  SMD1206R500SF  SMD-PPTC-500MA(1206)  [F1206]
F46  SMD1206R500SF  SMD-PPTC-500MA(1206)  [F1206]
F47  SMD1206R500SF  SMD-PPTC-500MA(1206)  [F1206]
F48  SMD1206R500SF  SMD-PPTC-500MA(1206)  [F1206]
F49  SMD1206R500SF  SMD-PPTC-500MA(1206)  [F1206]
F50  SMD1206R500SF  SMD-PPTC-500MA(1206)  [F1206]
F51  SMD1206R500SF  SMD-PPTC-500MA(1206)  [F1206]
F52  SMD1206R500SF  SMD-PPTC-500MA(1206)  [F1206]
F53  SMD1206R500SF  SMD-PPTC-500MA(1206)  [F1206]
F54  SMD1206R500SF  SMD-PPTC-500MA(1206)  [F1206]
F55  SMD1206R500SF  SMD-PPTC-500MA(1206)  [F1206]
I2C_1  JST-XH-05-PIN-ROUND-PAD  [JST-XH-05-PACKAGE-ROUND-PAD]
I2C_2  JST-XH-05-PIN-ROUND-PAD  [JST-XH-05-PACKAGE-ROUND-PAD]
I2C_3  JST-XH-05-PIN-ROUND-PAD  [JST-XH-05-PACKAGE-ROUND-PAD]
I2C_4  JST-XH-05-PIN-ROUND-PAD  [JST-XH-05-PACKAGE-ROUND-PAD]
I2C_5  JST-XH-05-PIN-ROUND-PAD  [JST-XH-05-PACKAGE-ROUND-PAD]
I2C_6  JST-XH-05-PIN-ROUND-PAD  [JST-XH-05-PACKAGE-ROUND-PAD]
I2C_7  JST-XH-05-PIN-ROUND-PAD  [JST-XH-05-PACKAGE-ROUND-PAD]
I2C_8  JST-XH-05-PIN-ROUND-PAD  [JST-XH-05-PACKAGE-ROUND-PAD]
I2C_9  JST-XH-05-PIN-ROUND-PAD  [JST-XH-05-PACKAGE-ROUND-PAD]
I2C_10  JST-XH-05-PIN-ROUND-PAD  [JST-XH-05-PACKAGE-ROUND-PAD]
I_UART_HUB_1  JST-XH-05-PIN-ROUND-PAD  [JST-XH-05-PACKAGE-ROUND-PAD]
PI_ADC_1  JST-XH-07-PIN-ROUND-PAD  [JST-XH-07-PACKAGE-ROUND-PAD]
PI_ADC_2  JST-XH-07-PIN-ROUND-PAD  [JST-XH-07-PACKAGE-ROUND-PAD]
PI_ADC_3  JST-XH-07-PIN-ROUND-PAD  [JST-XH-07-PACKAGE-ROUND-PAD]
PI_ADC_4  JST-XH-07-PIN-ROUND-PAD  [JST-XH-07-PACKAGE-ROUND-PAD]
PI_RS_485  JST-XH-05-PIN-ROUND-PAD  [JST-XH-05-PACKAGE-ROUND-PAD]
PI_UART  JST-XH-05-PIN-ROUND-PAD  [JST-XH-05-PACKAGE-ROUND-PAD]
PI_UART_HUB_2  JST-XH-05-PIN-ROUND-PAD  [JST-XH-05-PACKAGE-ROUND-PAD]
PI_UART_HUB_3  JST-XH-05-PIN-ROUND-PAD  [JST-XH-05-PACKAGE-ROUND-PAD]
SPI_1  JST-XH-07-PIN-ROUND-PAD  [JST-XH-07-PACKAGE-ROUND-PAD]
SPI_2  JST-XH-07-PIN-ROUND-PAD  [JST-XH-07-PACKAGE-ROUND-PAD]
SPI_3  JST-XH-07-PIN-ROUND-PAD  [JST-XH-07-PACKAGE-ROUND-PAD]
SPI_4  JST-XH-07-PIN-ROUND-PAD  [JST-XH-07-PACKAGE-ROUND-PAD]
SPI_5  JST-XH-07-PIN-ROUND-PAD  [JST-XH-07-PACKAGE-ROUND-PAD]
SPI_6  JST-XH-07-PIN-ROUND-PAD  [JST-XH-07-PACKAGE-ROUND-PAD]
SPI_7  JST-XH-07-PIN-ROUND-PAD  [JST-XH-07-PACKAGE-ROUND-PAD]
SPI_8  JST-XH-07-PIN-ROUND-PAD  [JST-XH-07-PACKAGE-ROUND-PAD]

### Nets
3V3_SMOOTH: F3.1 F6.1 F8.1 F10.1 F12.1 F14.1 F16.1 F18.1 F20.1 F22.1 F23.1 F25.1 F27.1 F29.1 F31.1 F33.1 F35.1 F37.1 F39.1 F41.1 F43.1 F45.1 F47.1 F49.1 F51.1 F53.1 F55.1 ; also sheet 1,3,5
ADC1+: PI_ADC_1.3 ; also sheet 4
ADC1-: PI_ADC_1.4 ; also sheet 4
ADC2+: PI_ADC_1.5 ; also sheet 4
ADC2-: PI_ADC_1.6 ; also sheet 4
ADC3+: PI_ADC_2.3 ; also sheet 4
ADC3-: PI_ADC_2.4 ; also sheet 4
ADC4+: PI_ADC_2.5 ; also sheet 4
ADC4-: PI_ADC_2.6 ; also sheet 4
ADC5+: PI_ADC_3.3 ; also sheet 4
ADC5-: PI_ADC_3.4 ; also sheet 4
ADC6+: PI_ADC_3.5 ; also sheet 4
ADC6-: PI_ADC_3.6 ; also sheet 4
ADC7+: PI_ADC_4.3 ; also sheet 4
ADC7-: PI_ADC_4.4 ; also sheet 4
ADC8+: PI_ADC_4.5 ; also sheet 4
ADC8-: PI_ADC_4.6 ; also sheet 4
ADC_1_3V3_P: F41.2 PI_ADC_1.2
ADC_1_5V_P: F40.2 PI_ADC_1.1
ADC_2_3V3_P: F39.2 PI_ADC_2.2
ADC_2_5V_P: F38.2 PI_ADC_2.1
ADC_3_3V3_P: F43.2 PI_ADC_3.2
ADC_3_5V_P: F42.2 PI_ADC_3.1
ADC_4_3V3_P: F45.2 PI_ADC_4.2
ADC_4_5V_P: F44.2 PI_ADC_4.1
GND: I2C_1.5 I2C_2.5 I2C_3.5 I2C_4.5 I2C_5.5 I2C_6.5 I2C_7.5 I2C_8.5 I2C_9.5 I2C_10.5 I_UART_HUB_1.5 PI_ADC_1.7 PI_ADC_2.7 PI_ADC_3.7 PI_ADC_4.7 PI_RS_485.5 PI_UART.5 PI_UART_HUB_2.5 PI_UART_HUB_3.5 SPI_1.7 SPI_2.7 SPI_3.7 SPI_4.7 SPI_5.7 SPI_6.7 SPI_7.7 SPI_8.7 ; also sheet 1,2,3,5,7,8
PI_5V: F2.1 F4.1 F5.1 F7.1 F9.1 F11.1 F13.1 F15.1 F17.1 F19.1 F21.1 F24.1 F26.1 F28.1 F30.1 F32.1 F34.1 F36.1 F38.1 F40.1 F42.1 F44.1 F46.1 F48.1 F50.1 F52.1 F54.1 ; also sheet 1,3,5,7,8
PI_5V_SPI_1_P: F28.2 SPI_1.1
PI_I2C_2_5V_P: F9.2 I2C_3.1
PI_I2C_3V3_2_P: F10.2 I2C_3.2
PI_I2C_3V3_3: F6.2 I2C_1.2
PI_I2C_3V3_3_P: F8.2 I2C_2.2
PI_I2C_3V3_4_P: F12.2 I2C_4.2
PI_I2C_3V3_5_P: F14.2 I2C_6.2
PI_I2C_3V3_6_P: F22.2 I2C_5.2
PI_I2C_3V3_7_P: F16.2 I2C_7.2
PI_I2C_3V3_8_P: F18.2 I2C_8.2
PI_I2C_3V3_9_P: F20.2 I2C_9.2
PI_I2C_3V3_10_P: F37.2 I2C_10.2
PI_I2C_5V_3_P: F7.2 I2C_2.1
PI_I2C_5V_4_P: F11.2 I2C_4.1
PI_I2C_5V_5_P: F13.2 I2C_6.1
PI_I2C_5V_6_P: F21.2 I2C_5.1
PI_I2C_5V_7_P: F15.2 I2C_7.1
PI_I2C_5V_8_P: F17.2 I2C_8.1
PI_I2C_5V_9_P: F19.2 I2C_9.1
PI_I2C_5V_10_P: F36.2 I2C_10.1
PI_I2C_5V_P: F5.2 I2C_1.1
PI_RS485_3V3_P: F47.2 PI_RS_485.2
PI_RS485_5V_P: F46.2 PI_RS_485.1
PI_SPI_3V3_1_P: F29.2 SPI_1.2
PI_SPI_5V_2_P: F2.2 SPI_2.1
PI_UART_3V3_P: F51.2 PI_UART.2
PI_UART_5V_P: F50.2 PI_UART.1
PI_UART_HUB_1_3V3_P: F49.2 I_UART_HUB_1.2
PI_UART_HUB_1_5V_P: F48.2 I_UART_HUB_1.1
PI_UART_HUB_2_3V3_P: F53.2 PI_UART_HUB_2.2
PI_UART_HUB_2_5V_P: F52.2 PI_UART_HUB_2.1
RPI_CS1: SPI_1.3 ; also sheet 1
RPI_CS2: SPI_2.3 ; also sheet 1
RPI_CS3: SPI_3.3 ; also sheet 1
RPI_CS4: SPI_4.3 ; also sheet 1
RPI_CS5: SPI_5.3 ; also sheet 1
RPI_CS6: SPI_6.3 ; also sheet 1
RPI_CS7: SPI_7.3 ; also sheet 1
RPI_CS8: SPI_8.3 ; also sheet 1
RS485_A: PI_RS_485.3 ; also sheet 7
RS485_B: PI_RS_485.4 ; also sheet 7
SCL_3V3: I2C_1.4 I2C_2.4 I2C_3.4 I2C_4.4 I2C_5.4 I2C_6.4 I2C_7.4 I2C_8.4 I2C_9.4 I2C_10.4 ; also sheet 1,4
SDA_3V3: I2C_1.3 I2C_2.3 I2C_3.3 I2C_4.3 I2C_5.3 I2C_6.3 I2C_7.3 I2C_8.3 I2C_9.3 I2C_10.3 ; also sheet 1,4
SPI_3V3_2_P: F3.2 SPI_2.2
SPI_3V3_3_P: F23.2 SPI_3.2
SPI_3V3_4_P: F25.2 SPI_4.2
SPI_3V3_5_P: F27.2 SPI_5.2
SPI_3V3_6_P: F31.2 SPI_6.2
SPI_3V3_7_P: F33.2 SPI_7.2
SPI_3V3_8_P: F35.2 SPI_8.2
SPI_5V_3_P: F4.2 SPI_3.1
SPI_5V_4_P: F24.2 SPI_4.1
SPI_5V_5_P: F26.2 SPI_5.1
SPI_5V_6_P: F30.2 SPI_6.1
SPI_5V_7_P: F32.2 SPI_7.1
SPI_5V_8_P: F34.2 SPI_8.1
SPI_MISO: SPI_1.5 SPI_2.5 SPI_3.5 SPI_4.5 SPI_5.5 SPI_6.5 SPI_7.5 SPI_8.5 ; also sheet 1
SPI_MOSI: SPI_1.4 SPI_2.4 SPI_3.4 SPI_4.4 SPI_5.4 SPI_6.4 SPI_7.4 SPI_8.4 ; also sheet 1
SPI_SCLK: SPI_1.6 SPI_2.6 SPI_3.6 SPI_4.6 SPI_5.6 SPI_6.6 SPI_7.6 SPI_8.6 ; also sheet 1
UART1_RDX: I_UART_HUB_1.4 ; also sheet 8
UART1_TDX: I_UART_HUB_1.3 ; also sheet 8
UART2_RDX: PI_UART_HUB_2.4 ; also sheet 8
UART2_TDX: PI_UART_HUB_2.3 ; also sheet 8
UART3_RDX: PI_UART_HUB_3.4 ; also sheet 8
UART3_TDX: PI_UART_HUB_3.3 ; also sheet 8
UART_HUB_3_3V3_P: F55.2 PI_UART_HUB_3.2
UART_RX: PI_UART.4 ; also sheet 1
UART_TDX: PI_UART.3 ; also sheet 1
UART_USB_HUB_3_5V: F54.2 PI_UART_HUB_3.1

### Notes on the sheet
- ADC Sockets
- RS485 Rpi
- I2C can support up to 1008 slave devices
- RPI UART
- RPI HUB UART | RPI HUB UART
- RPI HUB UART
- Raspberry Pi connector sockets

## Sheet 7 of 8
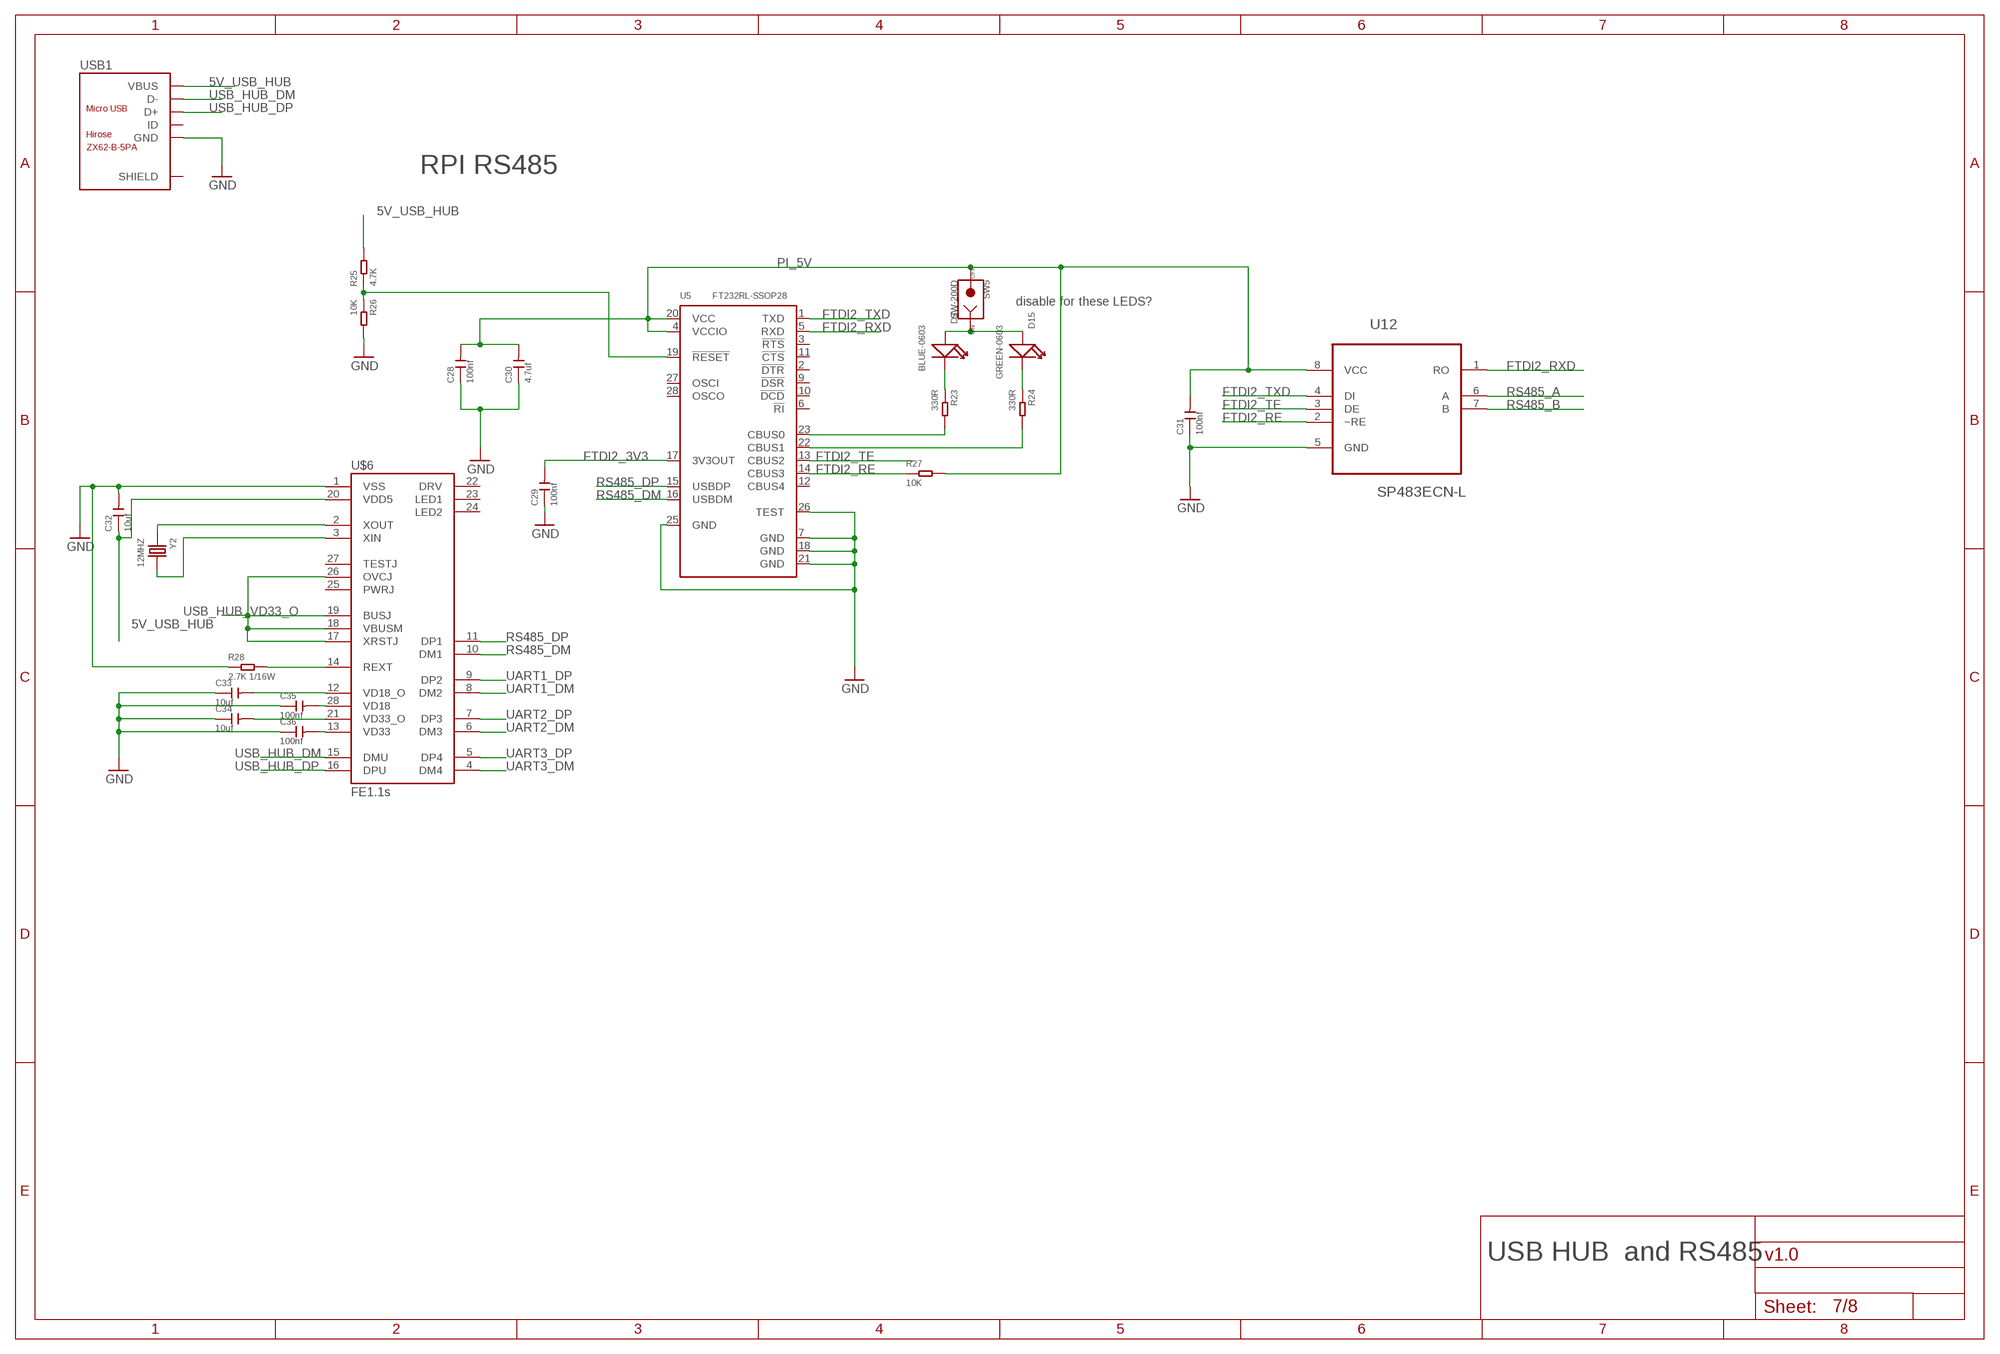
[diagram p7: schematic, sheet 7]

### Parts
C28  100nf  CERAMIC-100NF-50V-10%-X7R(0603)  [C0603]
C29  100nf  CERAMIC-100NF-50V-10%-X7R(0603)  [C0603]
C30  4.7uf  CERAMIC-4.7UF-10V-10%-X5R(0603)  [C0603]
C31  100nf  CERAMIC-100NF-50V-10%-X7R(0805)  [C0805]
C32  10uf  CERAMIC-10UF-25V-10%-X5R(0805)  [C0805]
C33  10uf  CERAMIC-10UF-25V-10%-X5R(0805)  [C0805]
C34  10uf  CERAMIC-10UF-25V-10%-X5R(0805)  [C0805]
C35  100nf  CERAMIC-100NF-50V-10%-X7R(0603)  [C0603]
C36  100nf  CERAMIC-100NF-50V-10%-X7R(0603)  [C0603]
D7  BLUE-0603  SMD-LED-CLEAR-BLUE(0603)  [LED-0603]
D15  GREEN-0603  SMD-LED-CLEAR-GREEN(0603)  [LED-0603]
R23  330R  SMD-RES-330R-1%-1/10W(0603)  [R0603]
R24  330R  SMD-RES-330R-1%-1/10W(0603)  [R0603]
R25  4.7K  SMD-RES-4.7K-5%-1/10W(0603)  [R0603]
R26  10K  SMD-RES-10K-1%-1/10W(0603)  [R0603]
R27  10K  SMD-RES-10K-1%-1/10W(0603)  [R0603]
R28  2.7K 1/16W  SMD-RES-2.7K-1%-1/16W(0402)  [R0402]
SW5  SW-200D  DIP-TILT-SWITCH-SW-200D(2P-12X3.6MM)  [SW2-12.7-12.0X3.6X3.6MM]
U5  FT232RL-SSOP28  INTERFACE-FT232RL(SSOP28)  [SSOP28-0.65-10.2X5.2MM]
U12  SP483ECN-L  [SOIC127P600X175-8N]
U$6  FE1.1S  [FE1.1S_SSOP-28]
USB1  ZX62-B-5PA  MICRO-USB-SMD(ZX62-B-5PA)  [MICRO-USB5+6P-SMD-0.65-AB]
Y2  12MHZ  SMD-CRYSTAL-12MHZ-20PF-20PPM-40R(2P-5.0X3.2MM)  [X2-SMD-5.0X3.2X1.3MM]

### Nets
5V_USB_HUB: C32.1 R25.2 U$6.20(VDD5) USB1.1(VBUS) ; also sheet 5,8
FTDI2_3V3: C29.2 U5.17(3V3OUT)
FTDI2_CBUS1: R23.2 U5.23(CBUS0)
FTDI2_RE: R27.1 U5.14(CBUS3) U12.2(~RE)
FTDI2_RXD: U5.5(RXD) U12.1(RO)
FTDI2_TE: U5.13(CBUS2) U12.3(DE)
FTDI2_TXD: U5.1(TXD) U12.4(DI)
FTID2_CBUS2: R24.2 U5.22(CBUS1)
GND: C28.1 C29.1 C30.1 C31.1 C32.2 C33.1 C34.1 C35.1 C36.1 R26.2 R28.1 U5.7(GND) U5.18(GND) U5.21(GND) U5.25(GND) U5.26(TEST) U12.5(GND) U$6.1(VSS) USB1.5(GND) ; also sheet 1,2,3,5,6,8
N$65: D7.+ D15.+ SW5.1
N$85: D7.- R23.1
N$92: D15.- R24.1
N$99: R25.1 R26.1 U5.19(!RESET)
N$102: U$6.2(XOUT) Y2.1
N$103: U$6.3(XIN) Y2.2
N$104: R28.2 U$6.14(REXT)
N$105: C35.2 U$6.28(VD18)
N$106: C36.2 U$6.13(VD33)
N$107: C34.2 U$6.21(VD33_O)
N$108: C33.2 U$6.12(VD18_O)
PI_5V: C28.2 C30.2 C31.2 R27.2 SW5.2 U5.4(VCCIO) U5.20(VCC) U12.8(VCC) ; also sheet 1,3,5,6,8
RS485_A: U12.6(A) ; also sheet 6
RS485_B: U12.7(B) ; also sheet 6
RS485_DM: U5.16(USBDM) U$6.10(DM1)
RS485_DP: U5.15(USBDP) U$6.11(DP1)
UART1_DM: U$6.8(DM2) ; also sheet 8
UART1_DP: U$6.9(DP2) ; also sheet 8
UART2_DM: U$6.6(DM3) ; also sheet 8
UART2_DP: U$6.7(DP3) ; also sheet 8
UART3_DM: U$6.4(DM4) ; also sheet 8
UART3_DP: U$6.5(DP4) ; also sheet 8
USB_HUB_DM: U$6.15(DMU) USB1.2(D-)
USB_HUB_DP: U$6.16(DPU) USB1.3(D+)
USB_HUB_VD33_O: U$6.17(XRSTJ) U$6.18(VBUSM) U$6.19(BUSJ) U$6.26(OVCJ)
Unconnected: U5.2(!DTR) U5.3(!RTS) U5.6(!RI) U5.9(!DSR) U5.10(!DCD) U5.11(!CTS) U5.12(CBUS4) U5.27(OSCI) U5.28(OSCO) U$6.22(DRV) U$6.23(LED1) U$6.24(LED2) U$6.25(PWRJ) U$6.27(TESTJ) USB1.4(ID) USB1.P1(SHIELD) USB1.P2(SHIELD) USB1.P3(SHIELD) USB1.P4(SHIELD) USB1.P5(SHIELD) USB1.P6(SHIELD)

### Notes on the sheet
- RPI RS485
- disable for these LEDS?
- USB HUB  and RS485

## Sheet 8 of 8
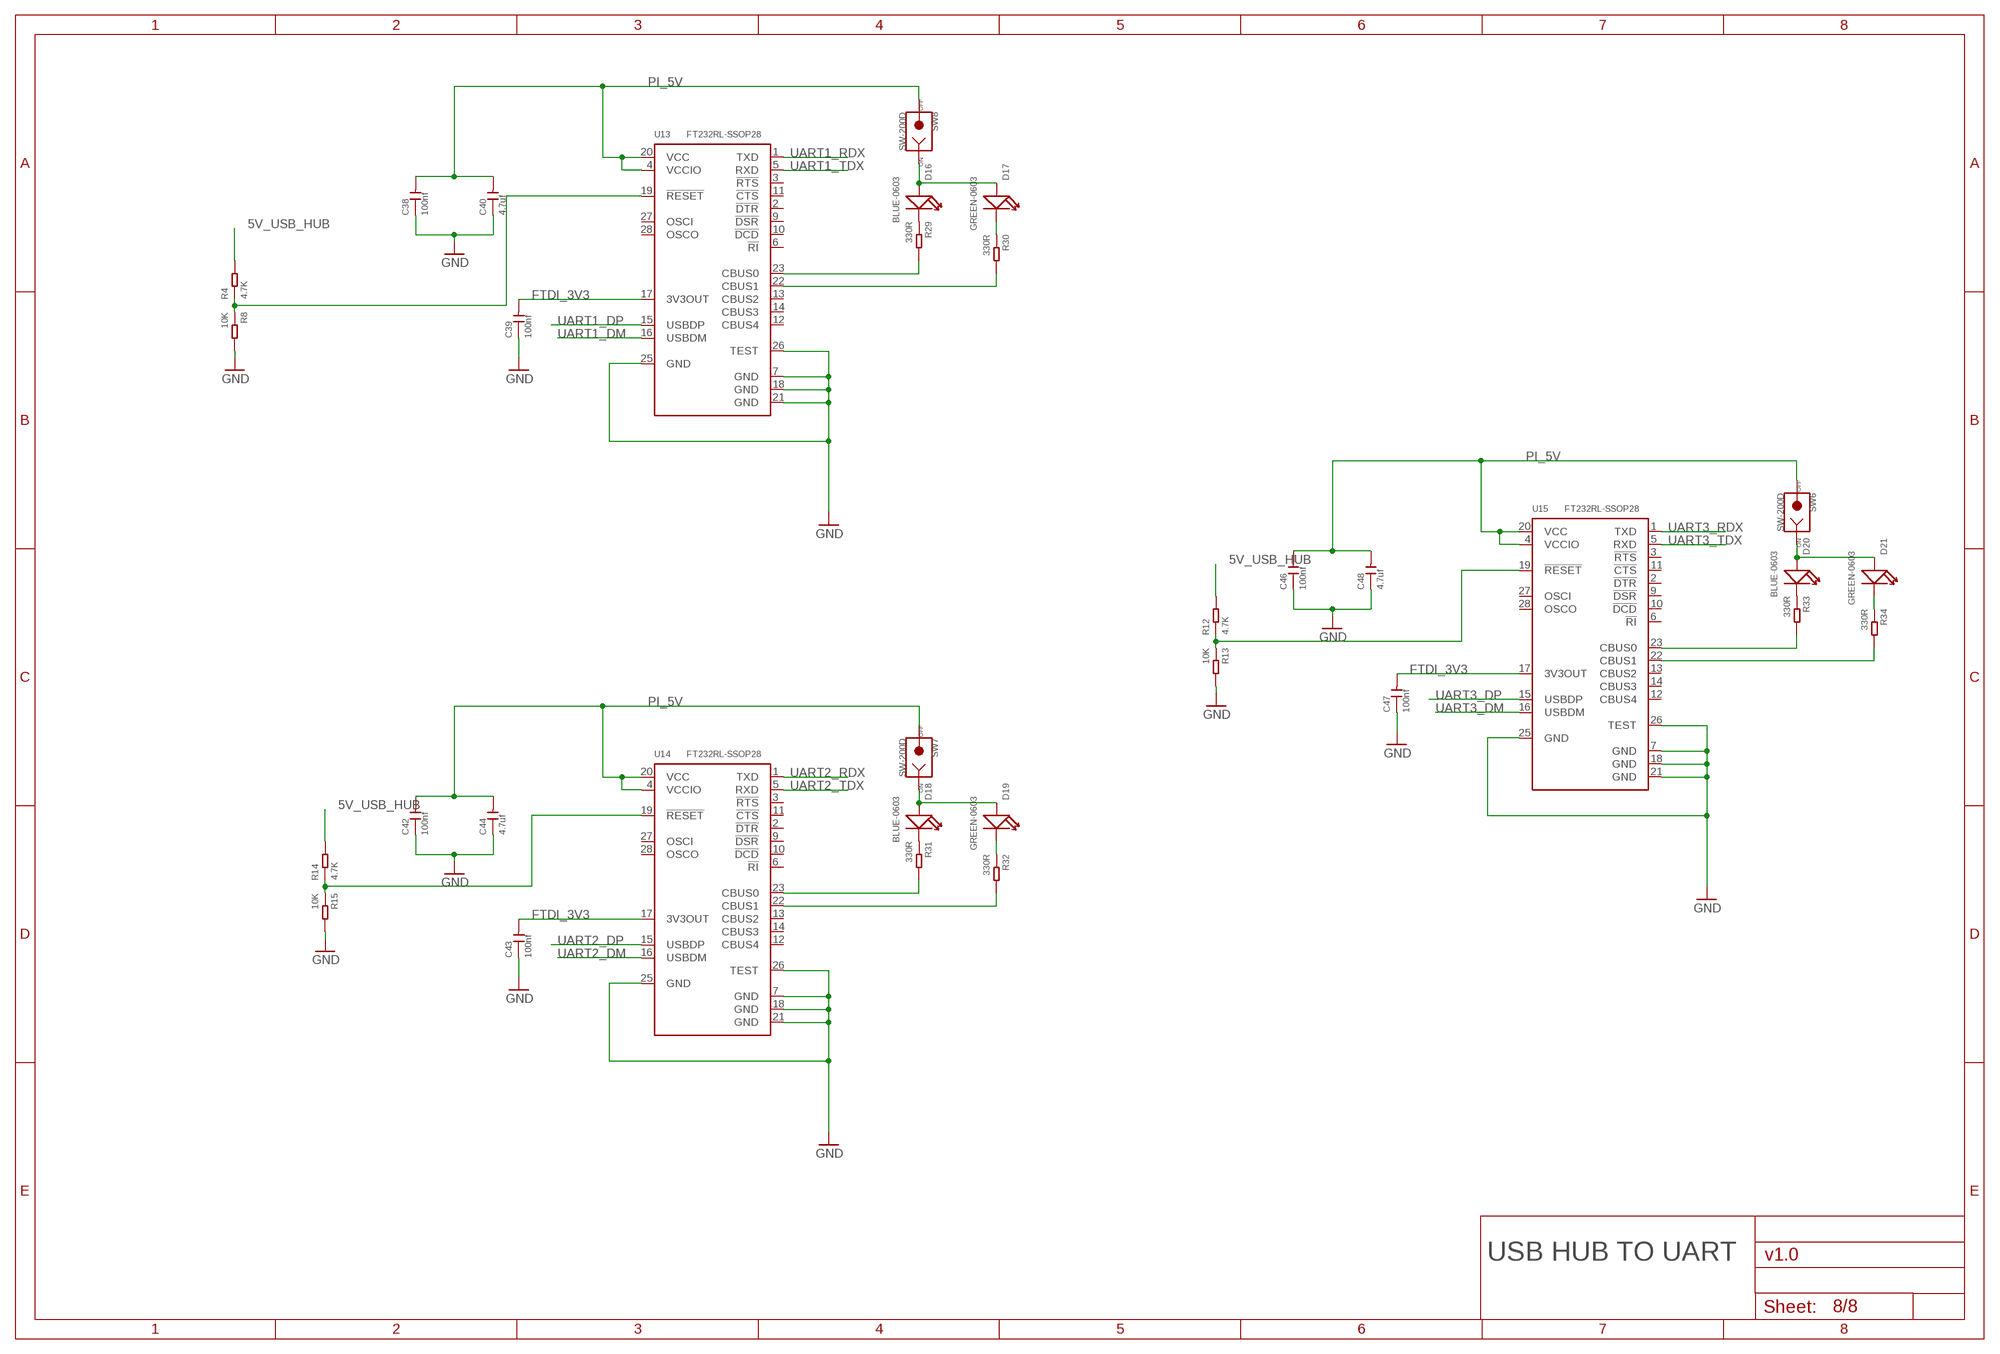
[diagram p8: schematic, sheet 8]

### Parts
C38  100nf  CERAMIC-100NF-50V-10%-X7R(0603)  [C0603]
C39  100nf  CERAMIC-100NF-50V-10%-X7R(0603)  [C0603]
C40  4.7uf  CERAMIC-4.7UF-10V-10%-X5R(0603)  [C0603]
C42  100nf  CERAMIC-100NF-50V-10%-X7R(0603)  [C0603]
C43  100nf  CERAMIC-100NF-50V-10%-X7R(0603)  [C0603]
C44  4.7uf  CERAMIC-4.7UF-10V-10%-X5R(0603)  [C0603]
C46  100nf  CERAMIC-100NF-50V-10%-X7R(0603)  [C0603]
C47  100nf  CERAMIC-100NF-50V-10%-X7R(0603)  [C0603]
C48  4.7uf  CERAMIC-4.7UF-10V-10%-X5R(0603)  [C0603]
D16  BLUE-0603  SMD-LED-CLEAR-BLUE(0603)  [LED-0603]
D17  GREEN-0603  SMD-LED-CLEAR-GREEN(0603)  [LED-0603]
D18  BLUE-0603  SMD-LED-CLEAR-BLUE(0603)  [LED-0603]
D19  GREEN-0603  SMD-LED-CLEAR-GREEN(0603)  [LED-0603]
D20  BLUE-0603  SMD-LED-CLEAR-BLUE(0603)  [LED-0603]
D21  GREEN-0603  SMD-LED-CLEAR-GREEN(0603)  [LED-0603]
R4  4.7K  SMD-RES-4.7K-5%-1/10W(0603)  [R0603]
R8  10K  SMD-RES-10K-1%-1/10W(0603)  [R0603]
R12  4.7K  SMD-RES-4.7K-5%-1/10W(0603)  [R0603]
R13  10K  SMD-RES-10K-1%-1/10W(0603)  [R0603]
R14  4.7K  SMD-RES-4.7K-5%-1/10W(0603)  [R0603]
R15  10K  SMD-RES-10K-1%-1/10W(0603)  [R0603]
R29  330R  SMD-RES-330R-1%-1/10W(0603)  [R0603]
R30  330R  SMD-RES-330R-1%-1/10W(0603)  [R0603]
R31  330R  SMD-RES-330R-1%-1/10W(0603)  [R0603]
R32  330R  SMD-RES-330R-1%-1/10W(0603)  [R0603]
R33  330R  SMD-RES-330R-1%-1/10W(0603)  [R0603]
R34  330R  SMD-RES-330R-1%-1/10W(0603)  [R0603]
SW6  SW-200D  DIP-TILT-SWITCH-SW-200D(2P-12X3.6MM)  [SW2-12.7-12.0X3.6X3.6MM]
SW7  SW-200D  DIP-TILT-SWITCH-SW-200D(2P-12X3.6MM)  [SW2-12.7-12.0X3.6X3.6MM]
SW8  SW-200D  DIP-TILT-SWITCH-SW-200D(2P-12X3.6MM)  [SW2-12.7-12.0X3.6X3.6MM]
U13  FT232RL-SSOP28  INTERFACE-FT232RL(SSOP28)  [SSOP28-0.65-10.2X5.2MM]
U14  FT232RL-SSOP28  INTERFACE-FT232RL(SSOP28)  [SSOP28-0.65-10.2X5.2MM]
U15  FT232RL-SSOP28  INTERFACE-FT232RL(SSOP28)  [SSOP28-0.65-10.2X5.2MM]

### Nets
5V_USB_HUB: R4.2 R12.2 R14.2 ; also sheet 5,7
FTDI_3V3: C39.2 C43.2 C47.2 U13.17(3V3OUT) U14.17(3V3OUT) U15.17(3V3OUT) ; also sheet 2
GND: C38.1 C39.1 C40.1 C42.1 C43.1 C44.1 C46.1 C47.1 C48.1 R8.2 R13.2 R15.2 U13.7(GND) U13.18(GND) U13.21(GND) U13.25(GND) U13.26(TEST) U14.7(GND) U14.18(GND) U14.21(GND) U14.25(GND) U14.26(TEST) U15.7(GND) U15.18(GND) U15.21(GND) U15.25(GND) U15.26(TEST) ; also sheet 1,2,3,5,6,7
N$5: R4.1 R8.1 U13.19(!RESET)
N$23: R12.1 R13.1 U15.19(!RESET)
N$31: R14.1 R15.1 U14.19(!RESET)
N$94: D20.+ D21.+ SW6.1
N$95: D18.+ D19.+ SW7.1
N$96: D16.+ D17.+ SW8.1
N$100: D16.- R29.1
N$101: D17.- R30.1
N$109: R29.2 U13.23(CBUS0)
N$110: R30.2 U13.22(CBUS1)
N$111: D18.- R31.1
N$112: D19.- R32.1
N$113: R31.2 U14.23(CBUS0)
N$114: R32.2 U14.22(CBUS1)
N$115: D20.- R33.1
N$116: D21.- R34.1
N$117: R33.2 U15.23(CBUS0)
N$118: R34.2 U15.22(CBUS1)
PI_5V: C38.2 C40.2 C42.2 C44.2 C46.2 C48.2 SW6.2 SW7.2 SW8.2 U13.4(VCCIO) U13.20(VCC) U14.4(VCCIO) U14.20(VCC) U15.4(VCCIO) U15.20(VCC) ; also sheet 1,3,5,6,7
UART1_DM: U13.16(USBDM) ; also sheet 7
UART1_DP: U13.15(USBDP) ; also sheet 7
UART1_RDX: U13.1(TXD) ; also sheet 6
UART1_TDX: U13.5(RXD) ; also sheet 6
UART2_DM: U14.16(USBDM) ; also sheet 7
UART2_DP: U14.15(USBDP) ; also sheet 7
UART2_RDX: U14.1(TXD) ; also sheet 6
UART2_TDX: U14.5(RXD) ; also sheet 6
UART3_DM: U15.16(USBDM) ; also sheet 7
UART3_DP: U15.15(USBDP) ; also sheet 7
UART3_RDX: U15.1(TXD) ; also sheet 6
UART3_TDX: U15.5(RXD) ; also sheet 6
Unconnected: U13.2(!DTR) U13.3(!RTS) U13.6(!RI) U13.9(!DSR) U13.10(!DCD) U13.11(!CTS) U13.12(CBUS4) U13.13(CBUS2) U13.14(CBUS3) U13.27(OSCI) U13.28(OSCO) U14.2(!DTR) U14.3(!RTS) U14.6(!RI) U14.9(!DSR) U14.10(!DCD) U14.11(!CTS) U14.12(CBUS4) U14.13(CBUS2) U14.14(CBUS3) U14.27(OSCI) U14.28(OSCO) U15.2(!DTR) U15.3(!RTS) U15.6(!RI) U15.9(!DSR) U15.10(!DCD) U15.11(!CTS) U15.12(CBUS4) U15.13(CBUS2) U15.14(CBUS3) U15.27(OSCI) U15.28(OSCO)

### Notes on the sheet
- USB HUB TO UART

## Library data of the parts
BAT1 = Seeed-Connector -2016:DIP-BATTERY-CELL-HOLDER(1220): 320170002
C1 C3 = Seeed-Capacitor:CERAMIC-10PF-50V-5%-NPO(0603): 302010097; MPN: CC0603JRNPO9BN100
C2 C6 C7 C11-C16 C19 C28 C29 C35 C36 C38 C39 C42 C43 C46 C47 = Seeed-Capacitor-2016:CERAMIC-100NF-50V-10%-X7R(0603): 302010138; MPN: CC0603KRX7R9BB104
C4 = Seeed-Capacitor:CERAMIC-10UF-10V-10%-X5R(0603): 302010103; MPN: CC0603KRX5R6BB106
C5 C8 = Seeed-Capacitor-2016:CERAMIC-1UF-6.3V-10%-X5R(0402): 302010003; MPN: CC0402KRX5R5BB105
C9 = Seeed-Capacitor-2016:CERAMIC-10NF-50V-5%-X7R(0805): 302010175; MPN: CC0805JRX7R9BB103
C10 = Seeed-Capacitor:TANTALUM-SMD-10UF-10V-10%(AVX-A): 302020011; MPN: TAJA106K010RNJ
C17 C30 C40 C44 C48 = Seeed-Capacitor-2016:CERAMIC-4.7UF-10V-10%-X5R(0603): 302010111; MPN: CC0603KRX5R6BB475
C18 = Seeed-Capacitor:CERAMIC-100NF-50V-10%-X7R(0603): 302010138; MPN: CC0603KRX7R9BB104
C31 = Seeed-Capacitor:CERAMIC-100NF-50V-10%-X7R(0805): 302010165; MPN: CC0805KRX7R9BB104
C32-C34 = Seeed-Capacitor-2016:CERAMIC-10UF-25V-10%-X5R(0805): 302010178; MPN: CC0805KKX5R8BB106
D1 = Seeed-Diode-2016:SMD-DIODE-SCHOTTKY-28V-5A(DO-214AA): 304020021; MPN: SS54B
D2 D7 D16 D18 D20 = Seeed-LED:SMD-LED-CLEAR-BLUE(0603): 304090045; MPN: 19-217-BHC-ZL1M2RY-3T
D3 D15 D17 D19 D21 = Seeed-LED:SMD-LED-CLEAR-GREEN(0603): 304090043; MPN: 19-217-G7C-AN1P2-3T
D4-D6 D8-D10 D13 D14 = Seeed-LED-2016:LED-SMD-RED-DIFFUSED(0603): 304090042; MPN: 19-217-R6C-AL1M2VY-3T
D11 = Seeed-LED-2016:SMD-LED-CLEAR-BLUE(0603): 304090045; MPN: 19-217-BHC-ZL1M2RY-3T
F1 = Seeed-OPL-2017-01-Fuse-Akita:307010005_DIP_PPTC_4A_0310: DIP PPTC 4A-30V;0310, RLD30P400UF 2P, SKU: 307010005
F2-F58 F74-F83 = Seeed-Fuse:SMD-PPTC-500MA(1206): 307010002; MPN: SMD1206R500SF
I2C_1-I2C_10 I_UART_HUB_1 LOPY_I2C LOPY_UART0 LOPY_UART1 PI_RS_485 PI_UART PI_UART_HUB_2 PI_UART_HUB_3 = Rembrandt Electronics - JST XH Connectors v1-0 2:JST-XH-05-PIN: JST XH Connector 2 Pin Wire to board connector. Pitch: 2,54 mm, (0.100") Number of pins: 5 Created by Rembrandt Electronics www.rembrandtelectronics.com
J1 = Seeed-Connector -2016:JACK-DC-044-A: 320120002; MPN: JACK-DC-044-A
J2 = Seeed-Connector:MICRO-SD-CARD-HOLDER-9P: 320090008
J3 J4 = Seeed-Connector:DIP-BLACK-MALE-HEADER-VERT(2P-2.54): 320020016; MPN: P125-1102A0BS116A1
J5 J6 = Seeed-Connector:DIP-BLACK-MALE-HEADER-VERT(16P-2.54): 320020034; MPN: P125-1116A0BS116AX
J7 = Seeed-Connector -2016:DIP-BLACK-MALE-HEADER(2X3P-2.54）: 320020077; MPN: P125-12A1BS116A1
J8 = Seeed-Connector -2016:DIP-BLACK-ROUND-FEMALE-HEADER-VERT(2P-2.54): 320030050; MPN: RF130-1023ABS0741
L1-L3 = Seeed-Inductor-2016:SMD-FERRITE-BEAD-330R-1500MA(0805): 303030006; MPN: BLM21PG331SN1D
LOPY_SPI PI_ADC_1-PI_ADC_4 SPI_1-SPI_8 = Rembrandt Electronics - JST XH Connectors v1-0 2:JST-XH-07-PIN: JST XH Connector 2 Pin Wire to board connector. Pitch: 2,54 mm, (0.100") Number of pins: 7 Created by Rembrandt Electronics www.rembrandtelectronics.com
PCB1 = e14_Rpi2_RevA:RPI2: Device for Raspberry Pi 2 board created by www.element14.com More information and support community is available at http://www.element14.com/community/community/raspberry-pi/raspberrypi2
Q2 Q5 = Seeed-Transistor:SMD-MOSFET-P-CH-20V-6A-SSM3J328R(SOT-23): 305030075; MPN: SSM3J328R,LF
Q3 = crystal:CRYTAL: CRYSTAL
Q4 = Seeed-Transistor:SMD-MOSFET-N-CH-50V-200MA-BSS138W-7-F(SOT-23): 305030000; MPN: BSS138W-7-F
R1 R3 R7 R23 R24 R29-R34 = Seeed-Resistor:SMD-RES-330R-1%-1/10W(0603): 301010300; MPN: RC0603FR-07330RL
R2 = Seeed-Resistor:SMD-RES-10K-5%-1/10W(0603): 301010293; MPN: RC0603JR-0710KL
R4 R12 R14 R25 = Seeed-Resistor:SMD-RES-4.7K-5%-1/10W(0603): 301010290; MPN: RC0603JR-074K7L
R5 R11 R35 = Seeed-Resistor-2016:SMD-RES-1K-1%-1/10W(0603): 301010298; MPN: RC0603FR-071KL
R6 R21 = Seeed-Resistor:SMD-RES-220R-5%-1/10W(0603): 301010163; MPN: RC0603JR-07220RL
R8 R13 R15 R16 R18 R19 R26 R27 = Seeed-Resistor:SMD-RES-10K-1%-1/10W(0603): 301010299; MPN: RC0603FR-0710KL
R9 R10 R22 = Seeed-Resistor:SMD-RES-100R-5%-1/10W(0603): 301010090; MPN: RC0603JR-07100RL
R20 = Seeed-Resistor:SMD-RES-15K-1%-1/10W(0603): 301010241; MPN: RC0603FR-0715KL
R28 = Seeed-Resistor-2016:SMD-RES-2.7K-1%-1/16W(0402): 301010671; MPN: RC0402FR-072K7L
R36 = Seeed-Resistor-2016:SMD-RES-1M-1%-1/10W(0603): 301010151; MPN: RC0603FR-071ML
R37 R38 = Seeed-Resistor-2016:SMD-RES-3.9K-5%-1/10W(0603): 301010101; MPN: RC0603JR-073K9L
R39 R40 = Seeed-Resistor:SMD-RES-100K-5%-1/10W(0603): 301010089; MPN: RC0603JR-07100KL
SW1-SW4 = Seeed-Switch:DIP-TILT-SWITCH-SW-200D(2P-12X3.6MM): 311100000; MPN: SW-200D
SW5-SW8 = Seeed-Switch-2016:DIP-TILT-SWITCH-SW-200D(2P-12X3.6MM): 311100000; MPN: SW-200D
TP1-TP8 = testpad:TP: Test pad
U1 = imported-parts:MCP23017-E/SO: IC, 16-Bit I/O Expander with Serial Interface, SOIC-28; MPN: MCP23017-E/SO; OC_FARNELL: 1332087; OC_NEWARK: 34M7442; PACKAGE: SOIC-28; SUPPLIER: Microchip
U2 = imported-parts:MCP79412-I/SN: RTCC, I2C, 1K EE, 64B SRAM, 8SOIC; MPN: MCP79412-I/SN; OC_FARNELL: 2103565; OC_NEWARK: 94T5863; PACKAGE: SOIC-8; SUPPLIER: Microchip
U3 = pycom:LOPY
U5 U6 U13-U15 = Seeed-IC:INTERFACE-FT232RL(SSOP28): 310070022; MPN: FT232RL
U7 = Seeed-Connector:DIP-IC-SOCKET(2X14P-2.54): 320070000; MPN: ICX-28P
U8 = farnell-parts:BR24G32-3: http://uk.farnell.com/rohm/br24g32fj-3gte2/serial-eeprom-32kbit-1mhz-sop/dp/2373743?MER=sy-me-pd-mi-alte
U10 = 74HC139N:74HC139N: Dual 2-to-4 line decoder/demultiplexer; MPN: 74HC139N; OC_FARNELL: 380556; OC_NEWARK: 07WX3674; PACKAGE: DIP-16; SUPPLIER: NXP
U11 = Diodes_Inc_By_element14_Batch_1:BZX84C30: 350mW SURFACE MOUNT ZENER DIODE; MPN: BZX84C30; OC_FARNELL: 1902456; OC_NEWARK: -; PACKAGE: SOT-23-3; SUPPLIER: DIODES INC.
U12 = SP483:SP483ECN-L: Transceiver; MPN: SP483ECN-L; OC_FARNELL: 9387129; OC_NEWARK: 24R0561; PACKAGE: SOIC-8; SUPPLIER: Exar
U$1 U$2 = MCP3424:MCP3424-E/SL: Analog-to-Digital Converter; MPN: MCP3424-E/SL; OC_FARNELL: 1630424; OC_NEWARK: 54M4871; PACKAGE: SOIC-14; SUPPLIER: Microchip
U$3 = C106DG_thyristor:C106DG
U$4 = mic29300:MCR29300
U$5 = diy-modules:DC-DC-STEP-DOWN-LM2596: DC/DC Step-Down Regulator based on LM2596-ADJ chip LM2596 datasheet available here: http://www.ti.com/lit/ds/symlink/lm2596.pdf Click here to find device on ebay.com <http://www.ebay.com/sch/lm2596+power+regulator>
U$6 = FE1.1s:FE1.1S: A USB 2.0 hub IC. http://www.jfd-ic.com/Documents/FE1.1s%20Data%20Sheet%20%28Rev.%201.0%29.pdf
U$7 = diy-modules:TEMP-HUM-SENSOR-DHT22: DHT22 - digital humidity & temperature sensor Also known as: AM2302 AM2302 datasheet available here: http://akizukidenshi.com/download/ds/aosong/AM2302.pdf Click here to find device on ebay.com <http://www.ebay.com/sch/dht22+digital+sensor>
USB1 USB3 = Seeed-Connector -2016:MICRO-USB-SMD(ZX62-B-5PA): 320010005; MPN: ZX62-B-5PA
Y2 = Seeed-Crystal Oscillator-2016:SMD-CRYSTAL-12MHZ-20PF-20PPM-40R(2P-5.0X3.2MM): 306010047; MPN: 5032/2P